# EAGLE design Baselli (EAGLE 6.5.0)
CREVISION: 0.1; DESIGNER: Pekka Nikander
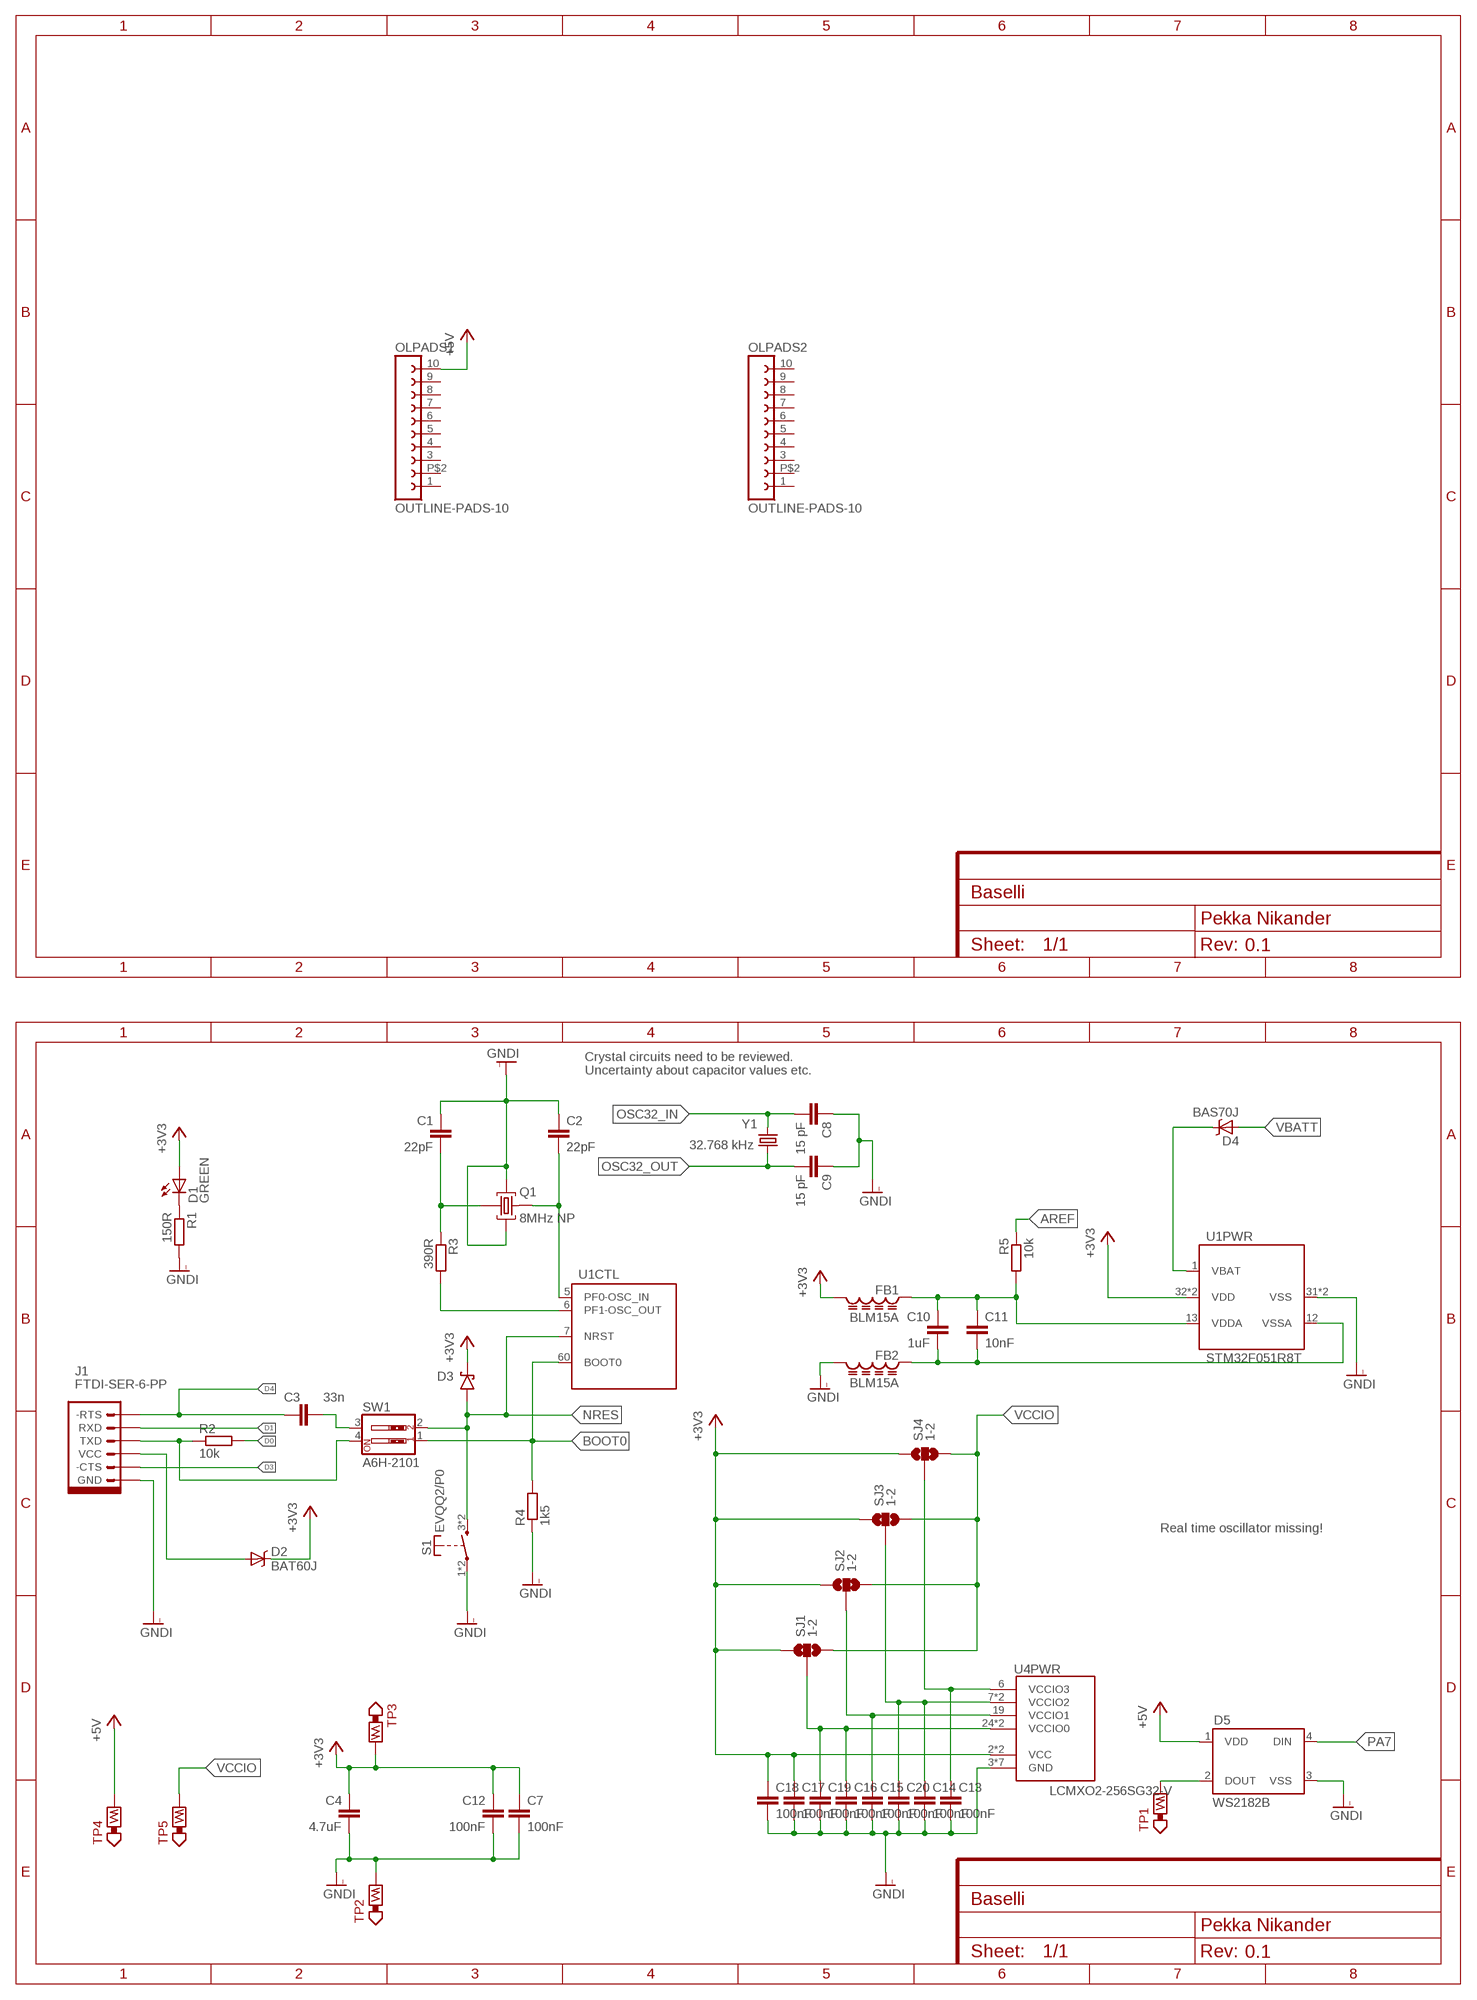
[diagram p0: schematic, sheet 1, part 1 of 2]
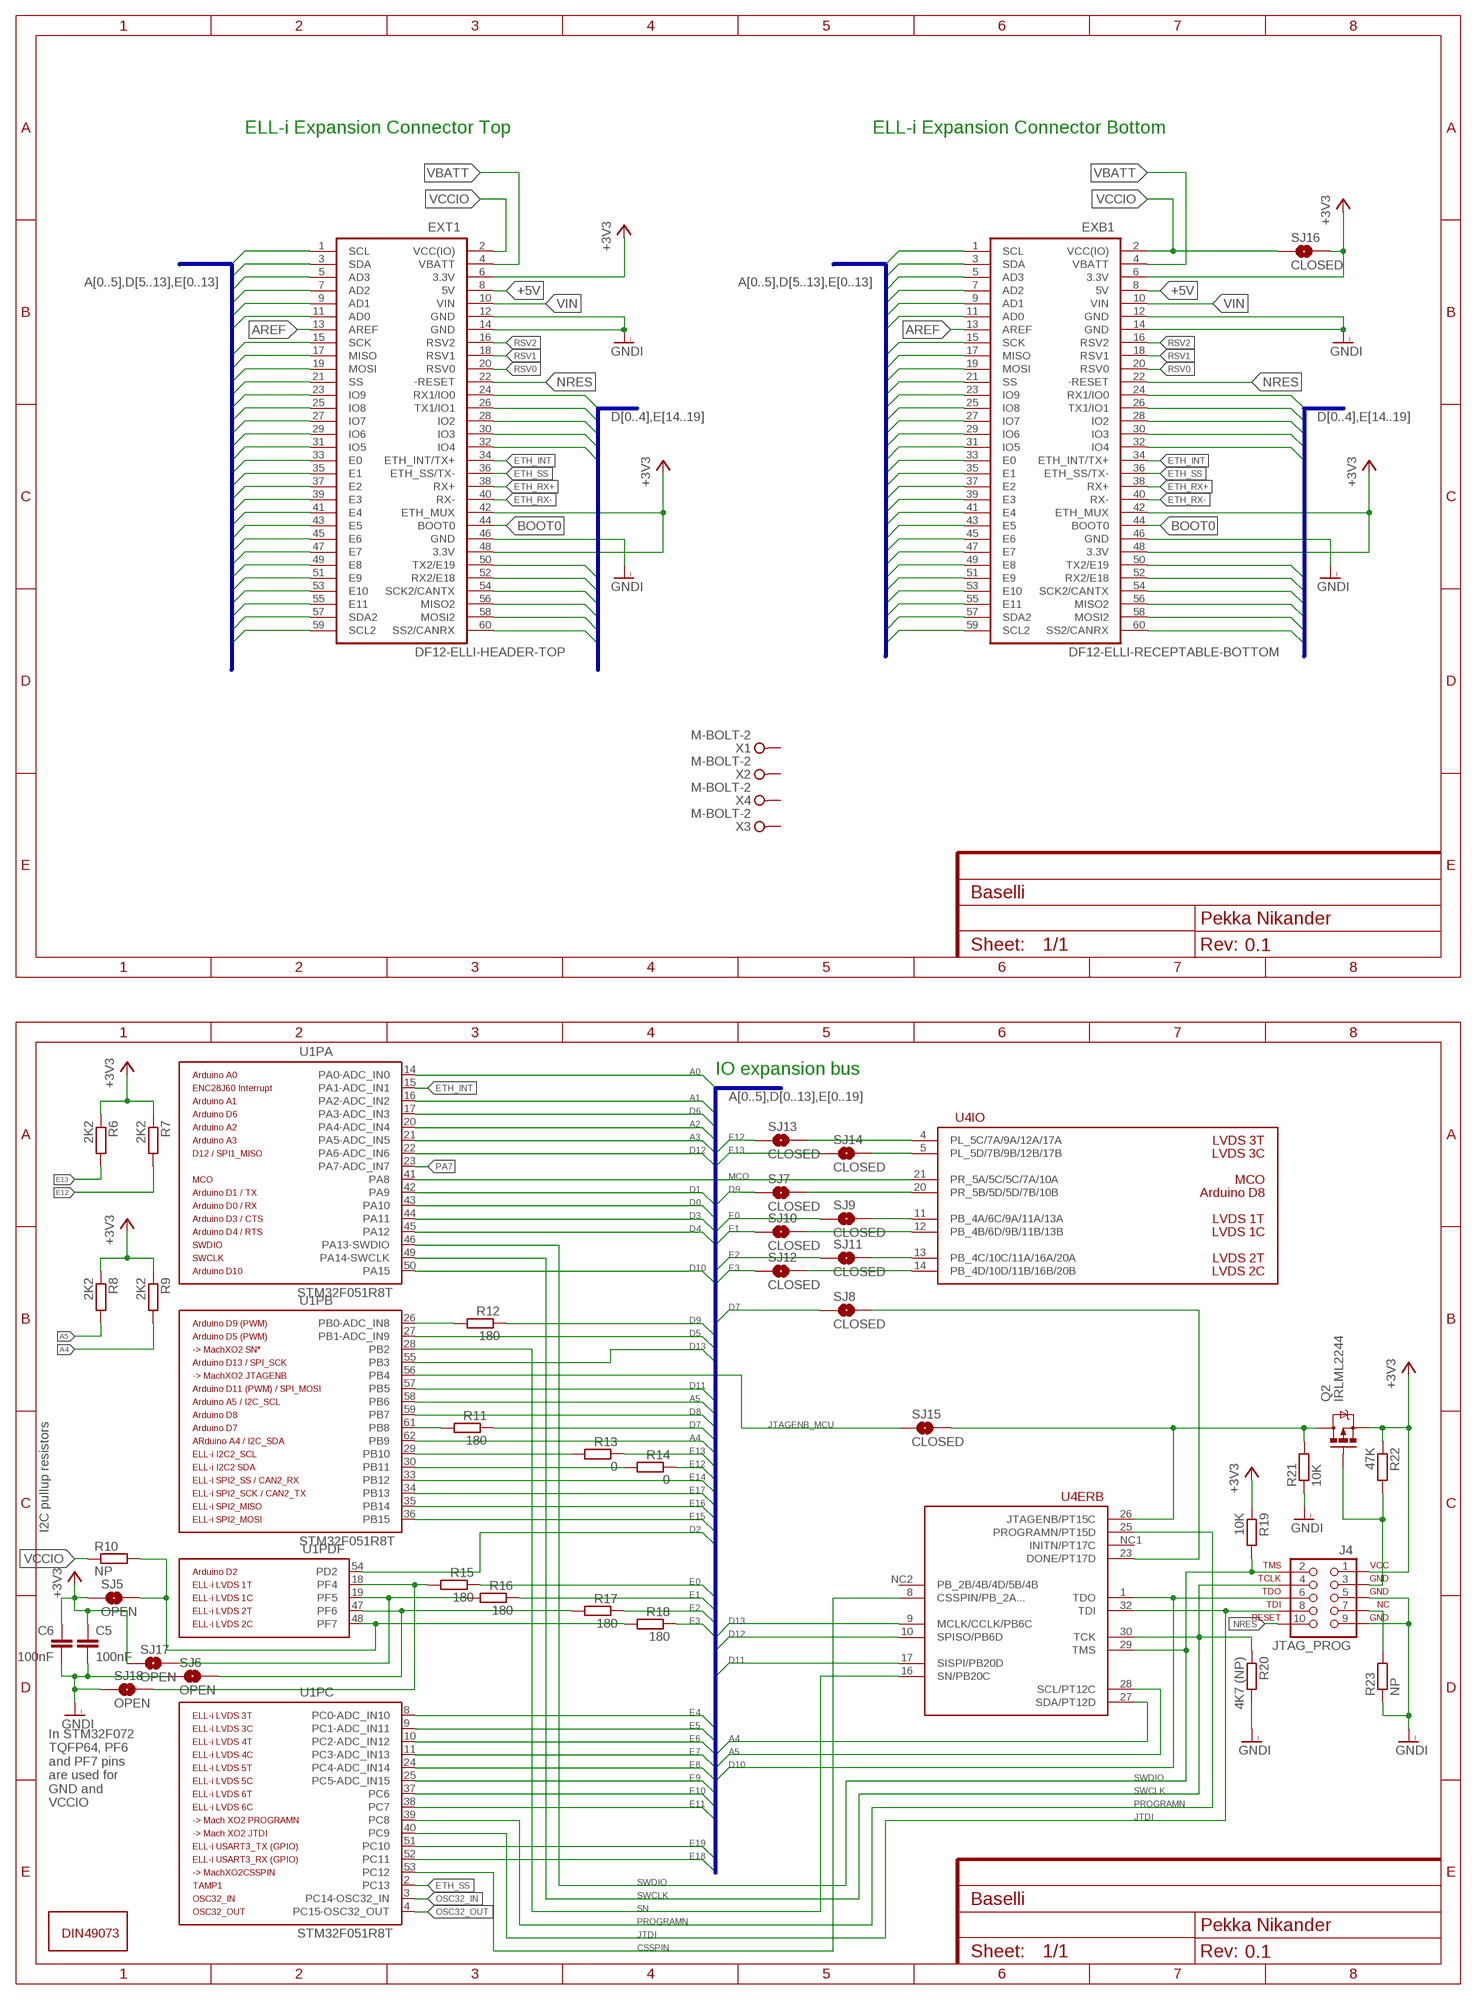
[diagram p1: schematic, sheet 1, part 2 of 2]

## Parts
C1  22pF  C0402  [C0402]
C2  22pF  C0402  [C0402]
C3  33n  C0402  [C0402]
C4  4.7uF  C0402  [C0402]
C5  100nF  C0402  [C0402]
C6  100nF  C0402  [C0402]
C7  100nF  C0402  [C0402]
C8  15 pF  C0402  [C0402]
C9  15 pF  C0402  [C0402]
C10  1uF  C0402  [C0402]
C11  10nF  C0402  [C0402]
C12  100nF  C0402  [C0402]
C13  100nF  C0402  [C0402]
C14  100nF  C0402  [C0402]
C15  100nF  C0402  [C0402]
C16  100nF  C0402  [C0402]
C17  100nF  C0402  [C0402]
C18  100nF  C0402  [C0402]
C19  100nF  C0402  [C0402]
C20  100nF  C0402  [C0402]
D1  GREEN  LED-GREEN0603  [LED-0603]
D2  BAT60J  DIODE-SCHOTTKY-BAT60J  [SOD-323]
D3  BAT60J  [SOD323_DIODE]
D4  BAS70J  [SOD-323]
D5  WS2182B  WS2812B  [WS2812B]
DIMENSIONS1  DIN49073-OUTLINE  [DIN49073-1:2010-02-OUTLINE]
EXB1  DF12-ELLI-RECEPTABLE-BOTTOM  [DF12-60DS-0.5V]
EXT1  DF12-ELLI-HEADER-TOP  [DF12(4.0)-60DP-0.5V]
FB1  BLM15A  LQM15  [0402]
FB2  BLM15A  LQM15  [0402]
J1  FTDI-SER-6-PP  [FTDI-SER-6-SIL]
J4  JTAG_PROG  [CLP-105-02-X-D]
OLPADS1  OUTLINE-PADS-10  [DIN49073-1:2010-02-PADS-10]
OLPADS2  OUTLINE-PADS-10  [DIN49073-1:2010-02-PADS-10]
Q1  8MHz NP  CRYSTAL_WITH_GND  [CRYSTAL-SMD-3225-GND]
Q2  IRLML2244  MOSFET-PCHANNELIRLML2244  [SOT23-3]
R1  150R  R0402  [R0402]
R2  10k  R0402  [R0402]
R3  390R  R0402  [R0402]
R4  1k5  R0402  [R0402]
R5  10k  R0805  [R0805]
R6  2K2  R0402  [R0402]
R7  2K2  R0402  [R0402]
R8  2K2  R0402  [R0402]
R9  2K2  R0402  [R0402]
R10  NP  R0805  [R0805]
R11  180  R0805  [R0805]
R12  180  R0805  [R0805]
R13  0  R0805  [R0805]
R14  0  R0805  [R0805]
R15  180  R0805  [R0805]
R16  180  R0805  [R0805]
R17  180  R0805  [R0805]
R18  180  R0805  [R0805]
R19  10K  R0402  [R0402]
R20  4K7 (NP)  R0603  [R0603]
R21  10K  R0402  [R0402]
R22  47K  R0402  [R0402]
R23  NP  R0805  [R0805]
S1  EVQQ2/P0  [EVQQ2/P0]
SJ1  1-2  SOLDERJUMPER_2WAYPASTE1&2  [SJ_3_PASTE1&2]
SJ2  1-2  SOLDERJUMPER_2WAYPASTE1&2  [SJ_3_PASTE1&2]
SJ3  1-2  SOLDERJUMPER_2WAYPASTE1&2  [SJ_3_PASTE1&2]
SJ4  1-2  SOLDERJUMPER_2WAYPASTE1&2  [SJ_3_PASTE1&2]
SJ5  OPEN  SOLDERJUMPERNO  [SJ_2S-NO]
SJ6  OPEN  SOLDERJUMPERNO  [SJ_2S-NO]
SJ7  CLOSED  SOLDERJUMPERTRACE  [SJ_2S-TRACE]
SJ8  CLOSED  SOLDERJUMPERTRACE  [SJ_2S-TRACE]
SJ9  CLOSED  SOLDERJUMPERTRACE  [SJ_2S-TRACE]
SJ10  CLOSED  SOLDERJUMPERTRACE  [SJ_2S-TRACE]
SJ11  CLOSED  SOLDERJUMPERTRACE  [SJ_2S-TRACE]
SJ12  CLOSED  SOLDERJUMPERTRACE  [SJ_2S-TRACE]
SJ13  CLOSED  SOLDERJUMPERTRACE  [SJ_2S-TRACE]
SJ14  CLOSED  SOLDERJUMPERTRACE  [SJ_2S-TRACE]
SJ15  CLOSED  SOLDERJUMPERTRACE  [SJ_2S-TRACE]
SJ16  CLOSED  SOLDERJUMPERTRACE  [SJ_2S-TRACE]
SJ17  OPEN  SOLDERJUMPERNO  [SJ_2S-NO]
SJ18  OPEN  SOLDERJUMPERNO  [SJ_2S-NO]
SW1  A6H-2101  SW_DIP-2-SMT-HALFSIZE  [DIPSWITCH-02-50MIL]
TP1  TEST_POINT-5000  [TP_5021]
TP2  TEST_POINT-5000  [TP_5021]
TP3  TEST_POINT-5000  [TP_5021]
TP4  TEST_POINT-5000  [TP_5021]
TP5  TEST_POINT-5000  [TP_5021]
U1  STM32F051R8T  [LQFP64]
U4  LCMXO2-256SG32-V  [QFN-32-PAD-VIAS]
X1  M-BOLT-2  [M2-1]
X2  M-BOLT-2  [M2-1]
X3  M-BOLT-2  [M2-1]
X4  M-BOLT-2  [M2-1]
Y1  32.768 kHz  CRYSTAL32-SMD  [CRYSTAL-32KHZ-SMD]

## Nets
+3V3 [power]: C4.1 C5.1 C6.1 C7.1 C12.1 C17.1 C18.1 D1.A D2.C D3.1(C) EXB1.6(3.3V) EXB1.42(ETH_MUX) EXB1.48(3.3V) EXT1.6(3.3V) EXT1.42(ETH_MUX) EXT1.48(3.3V) FB1.2 J4.1 Q2.2(S) R6.1 R7.1 R8.1 R9.1 R19.1 R22.1 SJ1.1 SJ2.1 SJ3.1 SJ4.1 SJ5.1 SJ16.2 SJ17.1 TP3.P$1 U1.32(PWR:VDD) U1.64(PWR:VDD) U4.2(PWR:VCC) U4.18(PWR:VCC)
+5V [power]: D5.1(VDD) EXB1.8(5V) EXT1.8(5V) OLPADS1.10 TP4.P$1
-RTS: C3.2 SW1.3
A0: EXB1.11(AD0) EXT1.11(AD0) U1.14(PA:PA0-ADC_IN0)
A1: EXB1.9(AD1) EXT1.9(AD1) U1.16(PA:PA2-ADC_IN2)
A2: EXB1.7(AD2) EXT1.7(AD2) U1.20(PA:PA4-ADC_IN4)
A3: EXB1.5(AD3) EXT1.5(AD3) U1.21(PA:PA5-ADC_IN5)
A4: EXB1.3(SDA) EXT1.3(SDA) R9.2 U1.62(PB:PB9) U4.27(ERB:SDA/PT12D)
A5: EXB1.1(SCL) EXT1.1(SCL) R8.2 U1.58(PB:PB6) U4.28(ERB:SCL/PT12C)
AREF [power]: EXB1.13(AREF) EXT1.13(AREF) R5.1
BOOT0: EXB1.44(BOOT0) EXT1.44(BOOT0) R4.2 SW1.1 U1.60(CTL:BOOT0)
BOOT0TX: J1.TXD R2.1 SW1.4
CSSPIN: U1.53(PC:PC12) U4.8(ERB:CSSPIN/PB_2A...)
D0: EXB1.24(RX1/IO0) EXT1.24(RX1/IO0) R2.2 U1.43(PA:PA10)
D1: EXB1.26(TX1/IO1) EXT1.26(TX1/IO1) J1.RXD U1.42(PA:PA9)
D2: EXB1.28(IO2) EXT1.28(IO2) U1.54(PDF:PD2)
D3: EXB1.30(IO3) EXT1.30(IO3) J1.-CTS U1.44(PA:PA11)
D4: C3.1 EXB1.32(IO4) EXT1.32(IO4) J1.-RTS U1.45(PA:PA12)
D5: EXB1.31(IO5) EXT1.31(IO5) U1.27(PB:PB1-ADC_IN9)
D6: EXB1.29(IO6) EXT1.29(IO6) U1.17(PA:PA3-ADC_IN3)
D7: EXB1.27(IO7) EXT1.27(IO7) R11.1 SJ8.1
D8: EXB1.25(IO8) EXT1.25(IO8) U1.59(PB:PB7)
D9: EXB1.23(IO9) EXT1.23(IO9) R12.1 SJ7.1
D10: EXB1.21(SS) EXT1.21(SS) J4.6 U1.50(PA:PA15) U4.1(ERB:TDO)
D11: EXB1.19(MOSI) EXT1.19(MOSI) U1.57(PB:PB5) U4.17(ERB:SISPI/PB20D)
D12: EXB1.17(MISO) EXT1.17(MISO) U1.22(PA:PA6-ADC_IN6) U4.10(ERB:SPISO/PB6D)
D13: EXB1.15(SCK) EXT1.15(SCK) U1.55(PB:PB3) U4.9(ERB:MCLK/CCLK/PB6C)
DONE: SJ8.2 U4.23(ERB:DONE/PT17D)
DOUT: D5.2(DOUT) TP1.P$1
E0: EXB1.33(E0) EXT1.33(E0) R15.1 SJ9.1
E1: EXB1.35(E1) EXT1.35(E1) R16.1 SJ10.1
E2: EXB1.37(E2) EXT1.37(E2) R17.1 SJ11.1
E3: EXB1.39(E3) EXT1.39(E3) R18.1 SJ12.1
E4: EXB1.41(E4) EXT1.41(E4) U1.8(PC:PC0-ADC_IN10)
E5: EXB1.43(E5) EXT1.43(E5) U1.9(PC:PC1-ADC_IN11)
E6: EXB1.45(E6) EXT1.45(E6) U1.10(PC:PC2-ADC_IN12)
E7: EXB1.47(E7) EXT1.47(E7) U1.11(PC:PC3-ADC_IN13)
E8: EXB1.49(E8) EXT1.49(E8) U1.24(PC:PC4-ADC_IN14)
E9: EXB1.51(E9) EXT1.51(E9) U1.25(PC:PC5-ADC_IN15)
E10: EXB1.53(E10) EXT1.53(E10) U1.37(PC:PC6)
E11: EXB1.55(E11) EXT1.55(E11) U1.38(PC:PC7)
E12: EXB1.57(SDA2) EXT1.57(SDA2) R7.2 R14.1 SJ13.1
E13: EXB1.59(SCL2) EXT1.59(SCL2) R6.2 R13.1 SJ14.1
E14: EXB1.60(SS2/CANRX) EXT1.60(SS2/CANRX) U1.33(PB:PB12)
E15: EXB1.58(MOSI2) EXT1.58(MOSI2) U1.36(PB:PB15)
E16: EXB1.56(MISO2) EXT1.56(MISO2) U1.35(PB:PB14)
E17: EXB1.54(SCK2/CANTX) EXT1.54(SCK2/CANTX) U1.34(PB:PB13)
E18: EXB1.52(RX2/E18) EXT1.52(RX2/E18) U1.52(PC:PC11)
E19: EXB1.50(TX2/E19) EXT1.50(TX2/E19) U1.51(PC:PC10)
ETH_INT: EXB1.34(ETH_INT/TX+) EXT1.34(ETH_INT/TX+) U1.15(PA:PA1-ADC_IN1)
ETH_RX+: EXB1.38(RX+) EXT1.38(RX+)
ETH_RX-: EXB1.40(RX-) EXT1.40(RX-)
ETH_SS: EXB1.36(ETH_SS/TX-) EXT1.36(ETH_SS/TX-) U1.2(PC:PC13)
GNDI [power]: C1.1 C2.1 C4.2 C5.2 C6.2 C7.2 C8.1 C9.1 C12.2 C13.2 C14.2 C15.2 C16.2 C17.2 C18.2 C19.2 C20.2 D5.3(VSS) EXB1.12(GND) EXB1.14(GND) EXB1.46(GND) EXT1.12(GND) EXT1.14(GND) EXT1.46(GND) FB2.2 J1.GND J4.5 J4.9 Q1.2(GND) Q1.4(GND) R1.2 R4.1 R20.2 R21.1 R23.1 S1.1(P) S1.2(P) SJ6.1 SJ18.1 TP2.P$1 U1.31(PWR:VSS) U1.63(PWR:VSS) U4.3(PWR:GND) U4.22(PWR:GND) U4.EP(PWR:GND) U4.VIA1(PWR:GND) U4.VIA2(PWR:GND) U4.VIA3(PWR:GND) U4.VIA4(PWR:GND)
JTAGEN_GATE: J4.3 Q2.1(G) R22.2
JTAGENB: Q2.3(D) R21.2 SJ15.2 U4.26(ERB:JTAGENB/PT15C)
JTAGENB_MCU: SJ15.1 U1.56(PB:PB4)
JTDI: J4.8 U1.40(PC:PC9) U4.32(ERB:TDI)
MCO: U1.41(PA:PA8) U4.21(IO:PR_5A/5C/5C/7A/10A)
N41567: D1.C R1.1
N205481: C1.2 Q1.1(C1) R3.1
N$5: R11.2 U1.61(PB:PB8)
N$6: J4.7 R23.2
N$7: R12.2 U1.26(PB:PB0-ADC_IN8)
N$9: SJ9.2 U4.11(IO:PB_4A/6C/9A/11A/13A)
N$10: SJ10.2 U4.12(IO:PB_4B/6D/9B/11B/13B)
N$12: SJ7.2 U4.20(IO:PR_5B/5D/5D/7B/10B)
N$15: SJ11.2 U4.13(IO:PB_4C/10C/11A/16A/20A)
N$16: SJ12.2 U4.14(IO:PB_4D/10D/11B/16B/20B)
N$17: SJ13.2 U4.4(IO:PL_5C/7A/9A/12A/17A)
N$20: SJ14.2 U4.5(IO:PL_5D/7B/9B/12B/17B)
NRES: D3.2(A) EXB1.22(-RESET) EXT1.22(-RESET) J4.10 S1.3(S) S1.4(S) SW1.2 U1.7(CTL:NRST)
OSC32_IN: C8.2 U1.3(PC:PC14-OSC32_IN) Y1.X2
OSC32_OUT: C9.2 U1.4(PC:PC15-OSC32_OUT) Y1.X1
PA7: D5.4(DIN) U1.23(PA:PA7-ADC_IN7)
PB10: R13.2 U1.29(PB:PB10)
PB11: R14.2 U1.30(PB:PB11)
PF0: C2.2 Q1.3(C2) U1.5(CTL:PF0-OSC_IN)
PF1: R3.2 U1.6(CTL:PF1-OSC_OUT)
PF4 [power]: R15.2 SJ18.2 U1.18(PDF:PF4)
PF5 [power]: R16.2 SJ17.2 U1.19(PDF:PF5)
PF6 [power]: R17.2 SJ6.2 U1.47(PDF:PF6)
PF7 [power]: R10.2 R18.2 SJ5.2 U1.48(PDF:PF7)
PROGRAMN: U1.39(PC:PC8) U4.25(ERB:PROGRAMN/PT15D)
RSV0: EXB1.20(RSV0) EXT1.20(RSV0)
RSV1: EXB1.18(RSV1) EXT1.18(RSV1)
RSV2: EXB1.16(RSV2) EXT1.16(RSV2)
SN: U1.28(PB:PB2) U4.16(ERB:SN/PB20C)
SWCLK: J4.4 R20.1 U1.49(PA:PA14-SWCLK) U4.30(ERB:TCK)
SWDIO: J4.2 R19.2 U1.46(PA:PA13-SWDIO) U4.29(ERB:TMS)
VBAT: D4.2(C) U1.1(PWR:VBAT)
VBATT: D4.1(A) EXB1.4(VBATT) EXT1.4(VBATT)
VCC-IN [power]: D2.A J1.VCC
VCCIO [power]: EXB1.2(VCC(IO)) EXT1.2(VCC(IO)) R10.1 SJ1.3 SJ2.3 SJ3.3 SJ4.3 SJ16.1 TP5.P$1
VCCIO0 [power]: C16.1 C19.1 SJ1.2 U4.24(PWR:VCCIO0) U4.31(PWR:VCCIO0)
VCCIO1 [power]: C15.1 SJ2.2 U4.19(PWR:VCCIO1)
VCCIO2 [power]: C14.1 C20.1 SJ3.2 U4.7(PWR:VCCIO2) U4.15(PWR:VCCIO2)
VCCIO3 [power]: C13.1 SJ4.2 U4.6(PWR:VCCIO3)
VDDA [power]: C10.1 C11.1 FB1.1 R5.2 U1.13(PWR:VDDA)
VIN: EXB1.10(VIN) EXT1.10(VIN)
VSSA [power]: C10.2 C11.2 FB2.1 U1.12(PWR:VSSA)
Unconnected: OLPADS1.1 OLPADS1.3 OLPADS1.4 OLPADS1.5 OLPADS1.6 OLPADS1.7 OLPADS1.8 OLPADS1.9 OLPADS1.P$2 OLPADS2.1 OLPADS2.3 OLPADS2.4 OLPADS2.5 OLPADS2.6 OLPADS2.7 OLPADS2.8 OLPADS2.9 OLPADS2.10 OLPADS2.P$2 U4.NC1(ERB:INITN/PT17C) U4.NC2(ERB:PB_2B/4B/4D/5B/4B) X1.1(KL1) X2.1(KL1) X3.1(KL1) X4.1(KL1)

## Buses
A[0..5],D[0..13],E[0..19]
A[0..5],D[5..13],E[0..13]
D[0..4],E[14..19]

## Notes on the sheet
- ELL-i Expansion Connector Top | ELL-i Expansion Connector Bottom
- Crystal circuits need to be reviewed.
  Uncertainty about capacitor values etc.
- IO expansion bus
- Real time oscillator missing! | I2C pullup resistors
- In STM32F072 
  TQFP64, PF6 
  and PF7 pins 
  are used for 
  GND and 
  VCCIO

## Library data of the parts
C1-C20 = ELL-i-Passives:C: Surface Mount Capasitors — in standard sizes A capacitor used to store energy electrostatically in an electric field. If you need a high-value capacitor, consider using a polarised capacitor to save space. Wikipedia article on capacitors <https://en.wikipedia.org/wiki/Capacitor>
D1 = SparkFun-LED:LED-GREEN: Various green LEDs Green LEDs used in SFE Production 0603- DIO-00821 LARGE- DIO-00862 LILYPAD- DIO-09910; PROD_ID: DIO-00821
D2 = SparkFun-DiscreteSemi:DIODE-SCHOTTKY: Schottky diodes BAT20J 1A 23V 0.62Vf BAT60J 3A 10V 0.53Vf (Datasheet <http://www.st.com/st-web-ui/static/active/en/resource/technical/document/datasheet/CD00001944.pdf>) RB751 120mA 40V 0.37Vf PMEG4005EJ 0.5A 40V 0.42Vf MBRA140 1A 40V 0.5Vf B340A 3A 40V SMA MBR120 20V 1A SOD123FL (Datasheet <http://www.mouser.com/ds/2/308/MBR120VLSFT1-D-107081.pdf>)
D3 = ell-i:BAT60J
D4 = ELL-i-DiscreteSemi:BAS70: Silicon Schottky Diodes General-purpose diode for high-speed switching. Maximum forward current 70 mA Maxiumum forward voltage drop Vf 0.410 mV Maximum reverse voltage 70V
D5 = SparkFun-LED:WS2812B: WS2812B - Intelligent control LED integrated light source Technical Specifications: Power Supply Voltage (VDD): 3.5 to 5.3 V Input Voltage (VI): -0.5 to VDD+0.5 V Operating Junction Temperature (Topt): -25°C to +80°C Storage Temperature Range (Tstg): -55°C to +150°C
DIMENSIONS1 = ELL-i-Boards:DIN49073: DIN49073 board Used to document in the schematic that the board outline is comliant with the DN49073 standard, and to select an appropriate dimension for the actual board.
EXB1 EXT1 = ELL-i-Connectors:DF12-ELLI-*
FB1 FB2 = ell-i:LQM15
J1 = ELL-i-Connectors:FTDI-SER-6: FTDI cable connector In several package variant, including pogopin version.
J4 = ELL-i-Connectors:JTAG_PROG: JTAG 10-pin ICSP Header This is an ARM / Keil compatible 10-pin 1.27 mm pitch In Circuit Serial Programming (ICSP) JTAG header. Keil Connectors <http://www.keil.com/support/man/docs/ulink2/ulink2_hw_connectors.htm>
OLPADS1 OLPADS2 = ELL-i-Boards:OUTLINE-PADS-10
Q1 = SparkFun-FreqCtrl:CRYSTAL_WITH_GND: Crystals with ground connection to case. A ground connection is used for mechanical stability and to minimize noise. Be careful to not overheat the body of crystal while soldering.
Q2 = SparkFun-DiscreteSemi:MOSFET-PCHANNEL: Generic PMOSFET; PROD_ID: TRANS-11153
R1-R23 = ELL-i-Passives:R: Surface Mount Resistor — in standard sizes
S1 = ell-i:EVQQ2/P0
SJ1-SJ4 = SparkFun-Passives:SOLDERJUMPER_2WAY: Solder Jumper 2 way solder jumper
SJ5-SJ18 = SparkFun-Passives:SOLDERJUMPER: Solder Jumper Standard SMD solder jumper. Used to automate production. Two varients : Normally Open and Normally Closed are the same, but have different paste layers. NC will have a large amount of paste and should jumper during reflow.
SW1 = SparkFun-Electromechanical:SW_DIP-2: DIP SWITCH
TP1-TP5 = ELL-i-Passives:TEST_POINT: Used for easier attachment of measuring equipment. Has both test loops and bare copper area.
U1 = ELL-i-DigitalIC:STM32F051R: STM32F051 in LQPF64 package. STM32F0-series Cortex-M0 microcontroller in 64 lead package. Datasheet <http://www.st.com/web/en/resource/technical/document/datasheet/DM00039193.pdf> (DM00039193.pdf) .; FLASH: 64K
U4 = ELL-i-DigitalIC:LCMXO2-256*SG32: MachXO2-256 in 32-pin QFN package. Lattice MachXO2-series FPGA in a 32-pin QFN package, 0.5 mm pitch. Datasheet <http://www.latticesemi.com/~/media/Documents/DataSheets/MachXO23/MachXO2FamilyDataSheet.pdf> (DS1035) .
X1-X4 = ELL-i-Connectors:M-BOLT: Metric bolt connector
Y1 = SparkFun-FreqCtrl:CRYSTAL: Various standard crystals. Proven footprints. Spark Fun Electronics SKU : COM-00534; PROD_ID: XTAL-07894

## Net classes
0 default: width 0.1 mm, drill 0.3 mm, clearance 0.1 mm
1 power: width 0.3 mm, drill 0.5 mm, clearance 0.15 mm
2 high_voltage: width 0.15 mm, drill 0.3 mm, clearance 0.5 mm
3 high_power: width 0.5 mm, drill 0.6 mm, clearance 0.15 mm

## Board
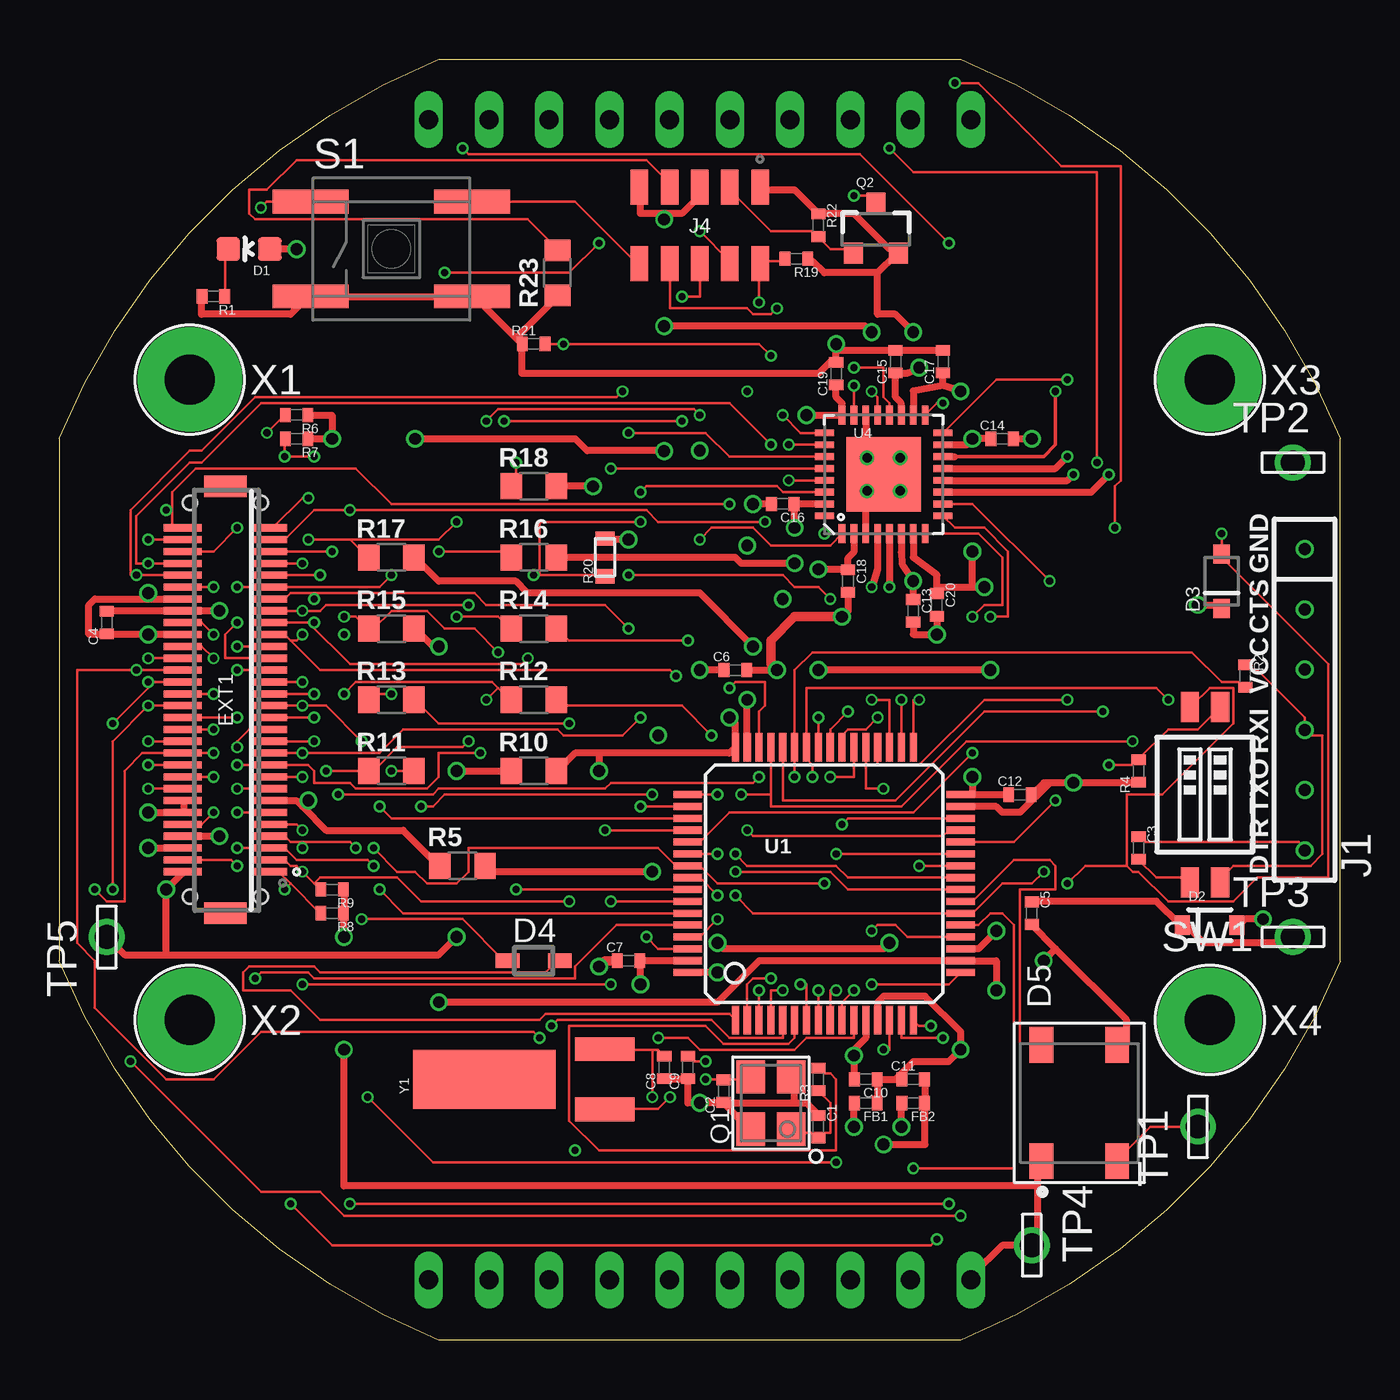
[diagram p2: board, top side]
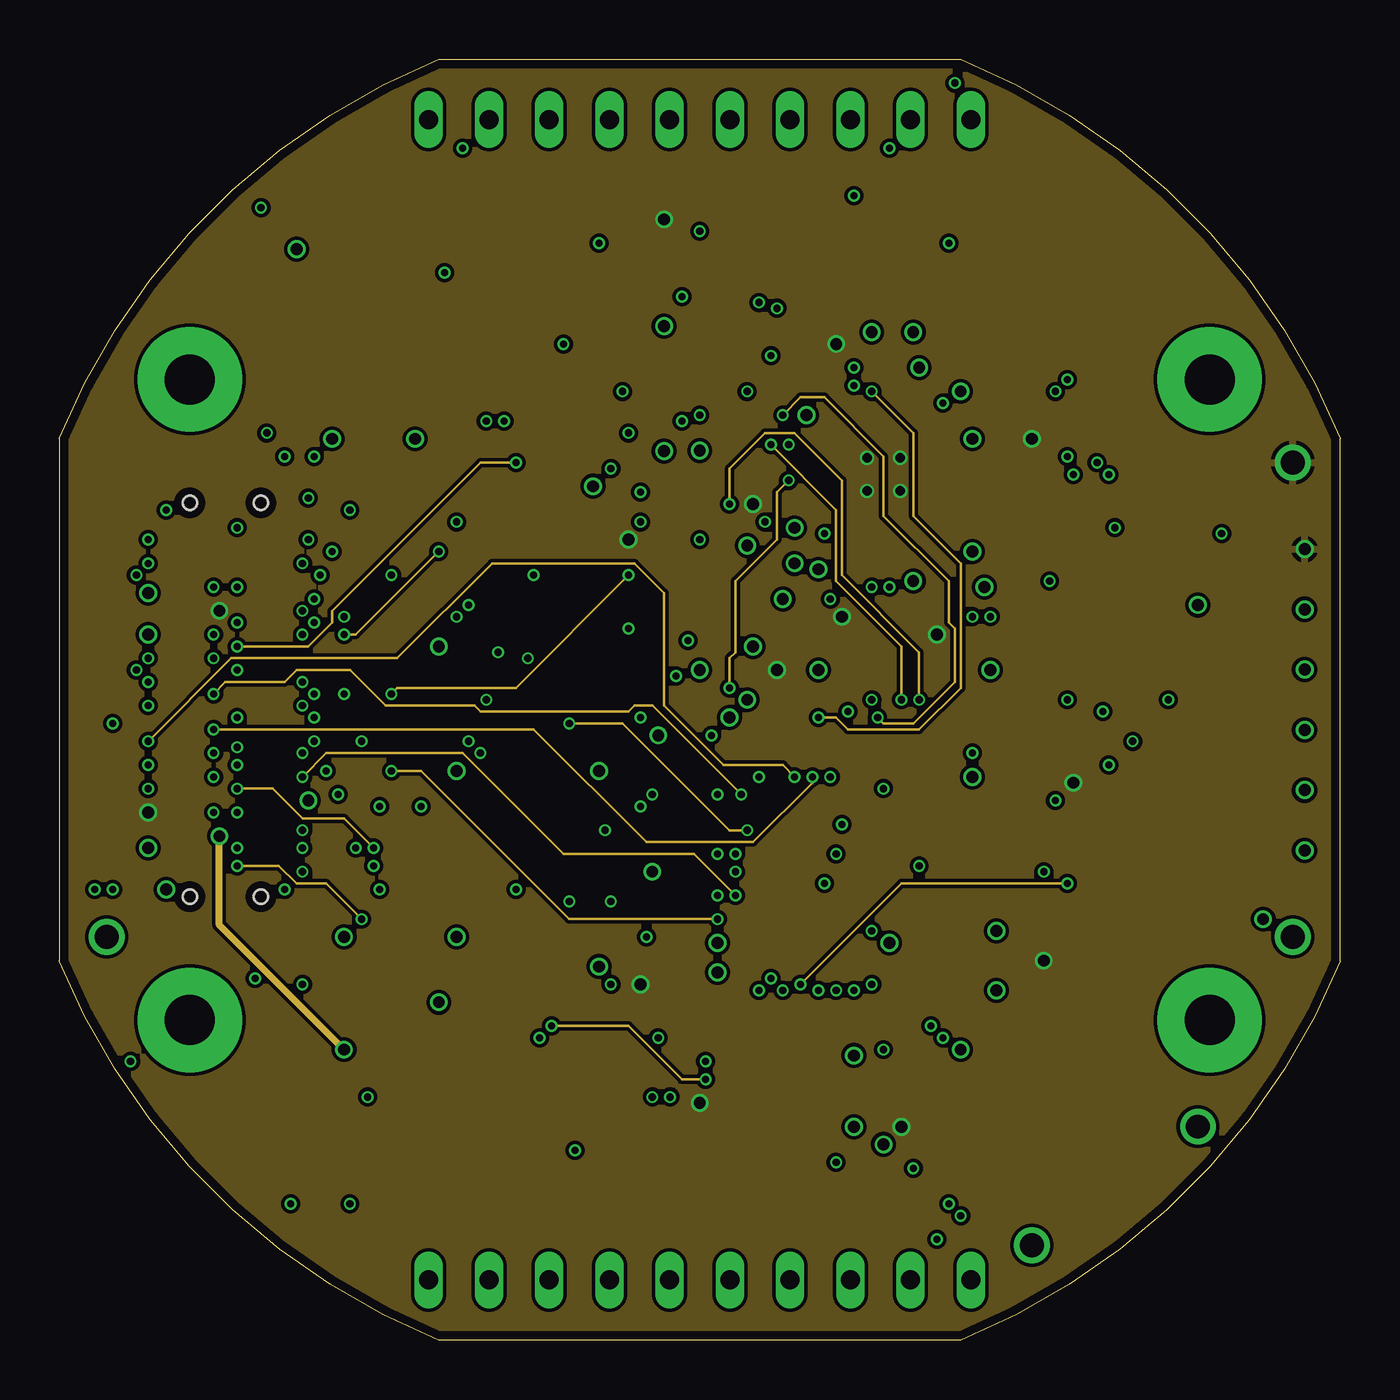
[diagram p3: board, inner layer Layer2]
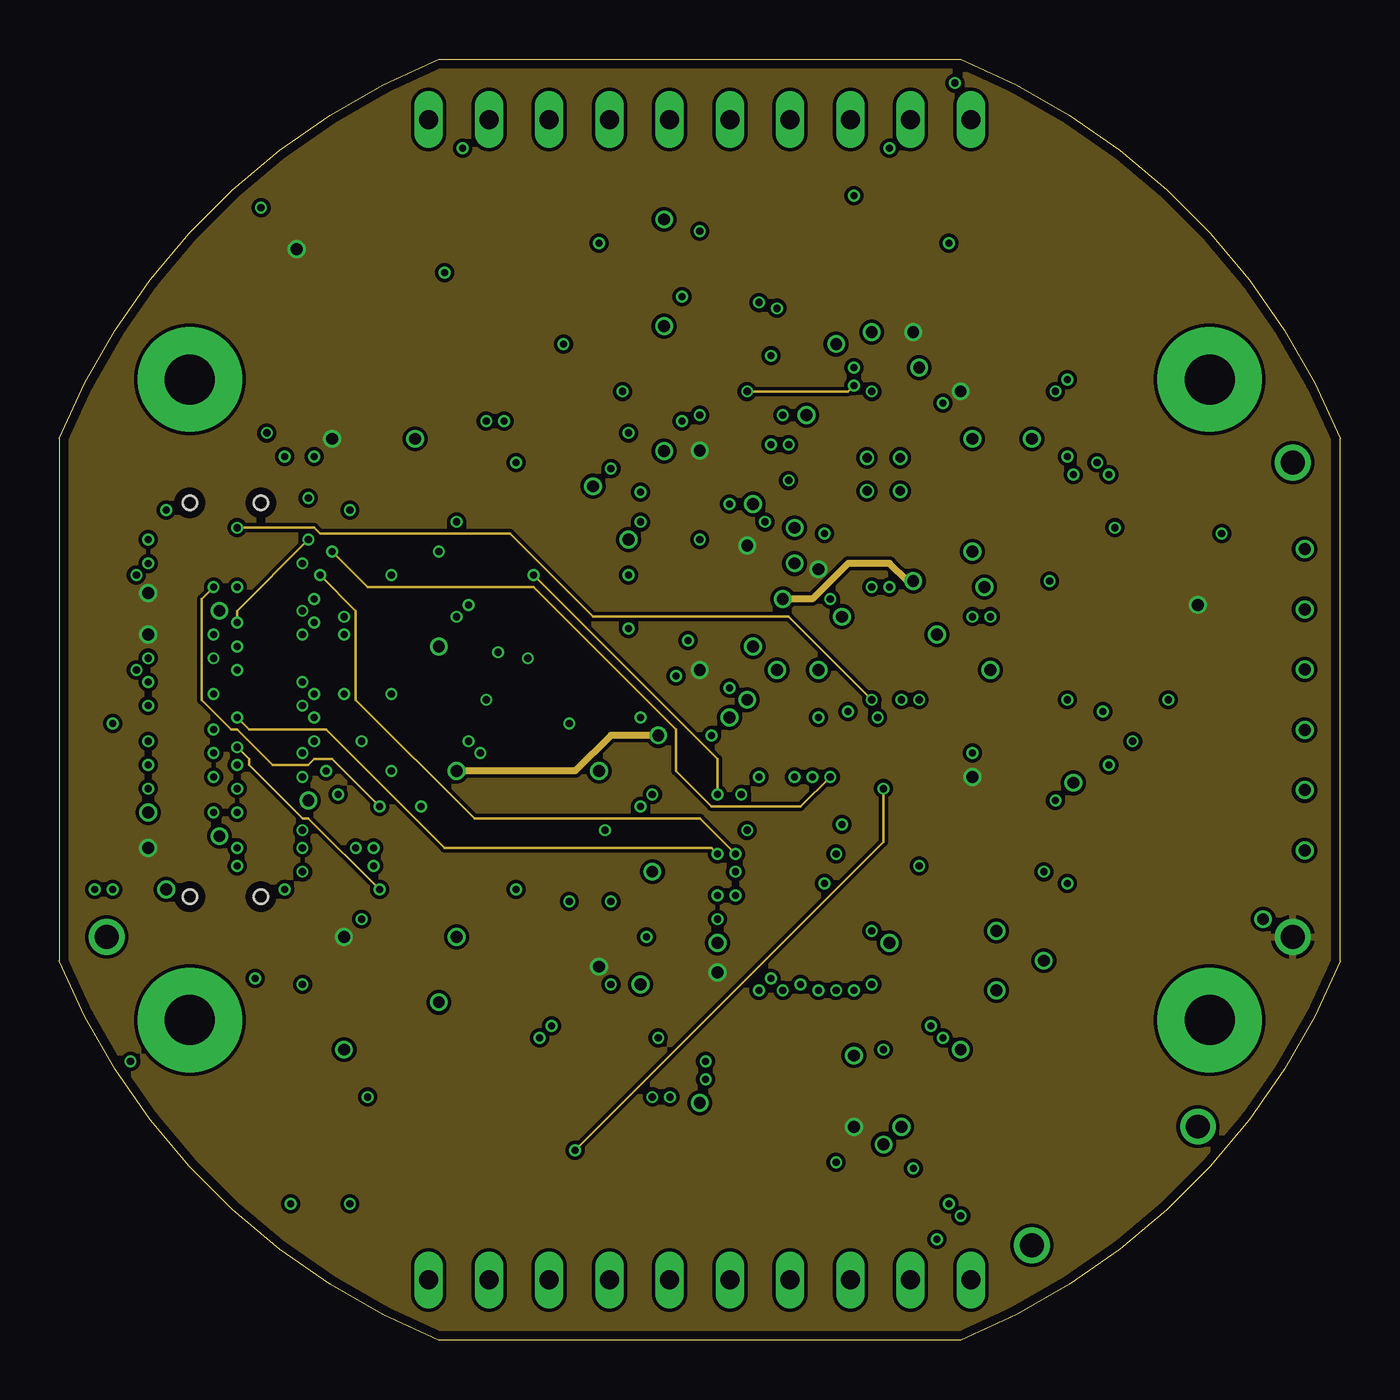
[diagram p4: board, inner layer Layer3]
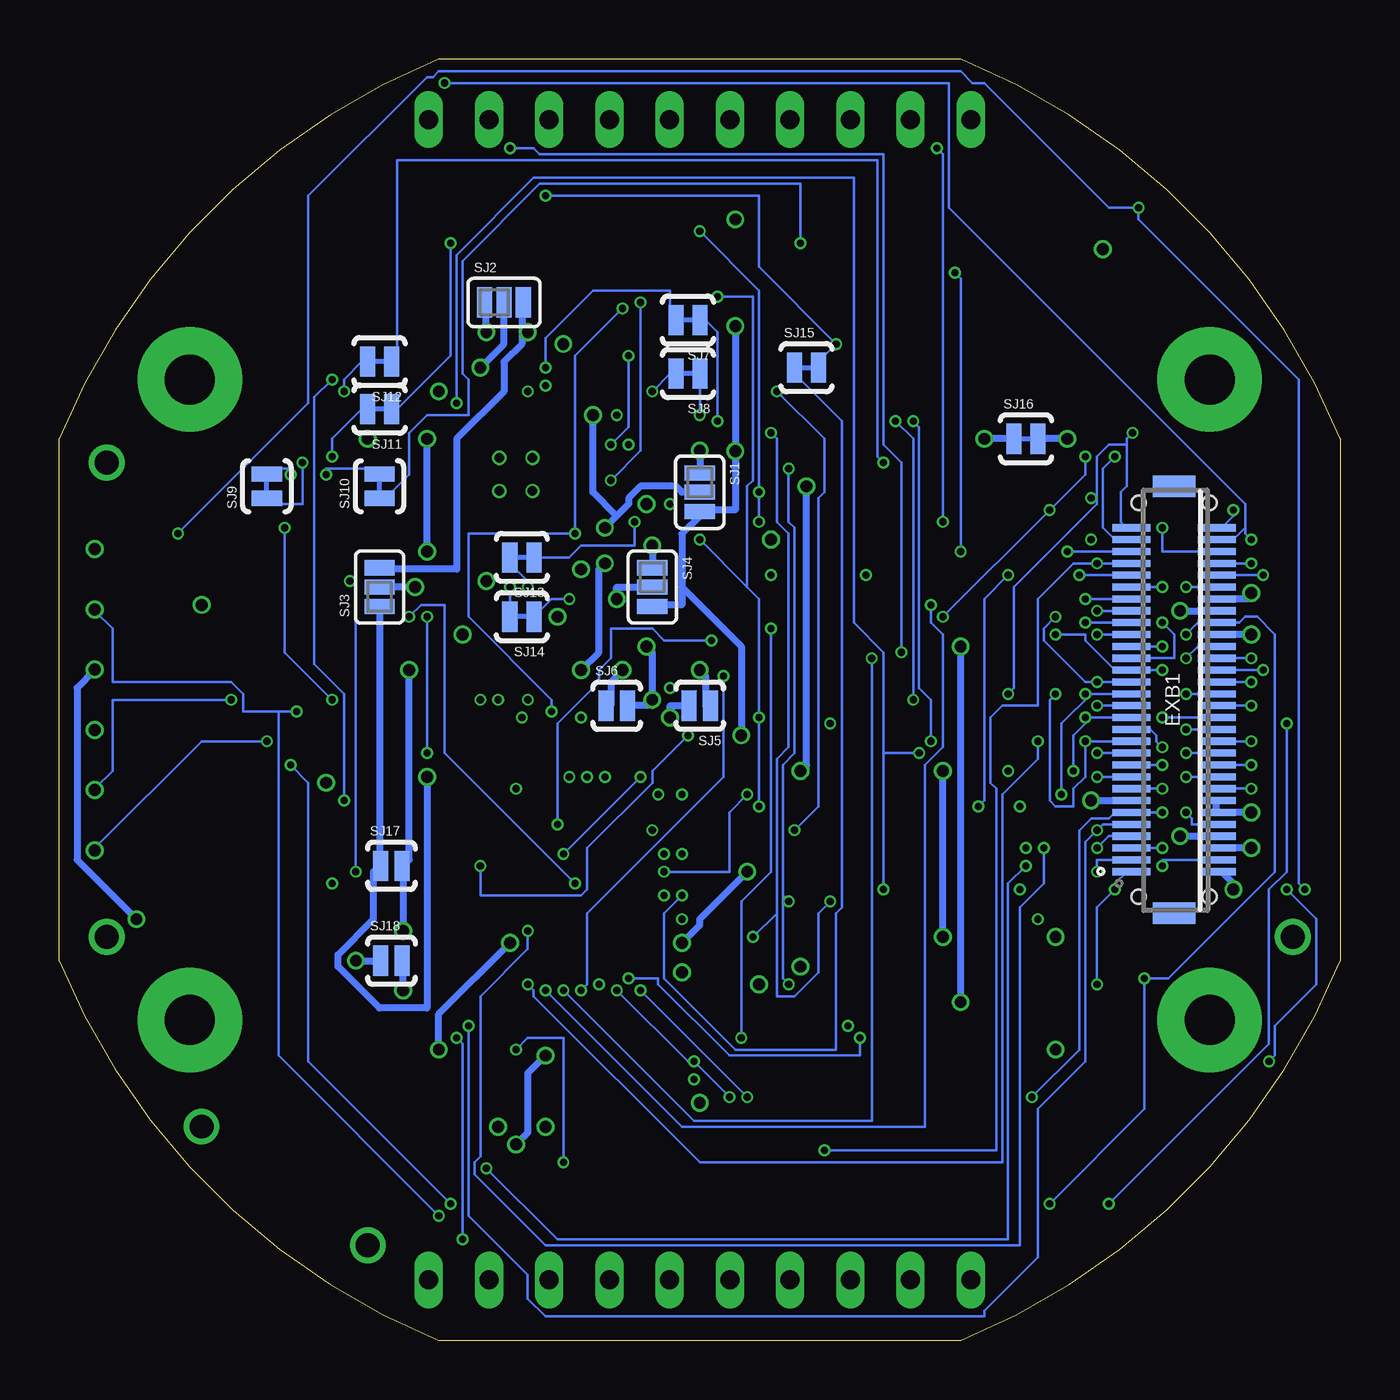
[diagram p5: board, bottom side, seen from below]

Size 54 x 54 mm. Coordinates in mm from the lower left corner, seen from the top.
Copper layers (1*2*15*16): Top 0.035mm / dielectric 0.2mm / Layer2 0.035mm / dielectric 1mm / Layer3 0.035mm / dielectric 0.2mm / Bottom 0.035mm
Design rules "Ell-duino *": minimum track width 0.1mm, minimum drill 0.2mm, track to track 0.1mm, track to pad 0.1mm, pad to pad 0.2mm, via to via 0.2mm, smd to smd 0.1mm, copper to edge 0.35mm, drill to drill 0.4mm, minimum pad ring 0.1mm, minimum via ring 0.1mm, stop-mask expansion 2mil, vias tented up to drill 0.29mm, thermal gap 0.18mm

### Footprints (pad centres in the part's own frame; a part is rotated, then mirrored left to right if it is on the bottom)
C0402 = smd 0.45 x 0.6: 1 -0.475,0; 2 0.475,0
LED-0603 = smd 1 x 1: A 0,-0.877; C 0,0.877
SOD-323 = smd 0.63 x 0.83: A 1.15,0; C -1.15,0
SOD323_DIODE = smd 0.8 x 0.7: 1 -1.15,0; 2 1.15,0
SOD-323' = smd 1 x 0.6: 1 -1.1,0; 2 1.1,0
WS2812B = smd 1.5 x 1: 1 -2.45,1.6; 2 -2.45,-1.6; 3 2.45,-1.6; 4 2.45,1.6
DF12-60DS-0.5V = smd 0.3 x 1.6: 1 -7.25,1.8; 2 -7.25,-1.8; 3 -6.75,1.8; 4 -6.75,-1.8; 5 -6.25,1.8; 6 -6.25,-1.8; 7 -5.75,1.8; 8 -5.75,-1.8; 9 -5.25,1.8; 10 -5.25,-1.8; 11 -4.75,1.8; 12 -4.75,-1.8; 13 -4.25,1.8; 14 -4.25,-1.8; 15 -3.75,1.8; 16 -3.75,-1.8; 17 -3.25,1.8; 18 -3.25,-1.8; 19 -2.75,1.8; 20 -2.75,-1.8; 21 -2.25,1.8; 22 -2.25,-1.8; 23 -1.75,1.8; 24 -1.75,-1.8; 25 -1.25,1.8; 26 -1.25,-1.8; 27 -0.75,1.8; 28 -0.75,-1.8; 29 -0.25,1.8; 30 -0.25,-1.8; 31 0.25,1.8; 32 0.25,-1.8; 33 0.75,1.8; 34 0.75,-1.8; 35 1.25,1.8; 36 1.25,-1.8; 37 1.75,1.8; 38 1.75,-1.8; 39 2.25,1.8; 40 2.25,-1.8; 41 2.75,1.8; 42 2.75,-1.8; 43 3.25,1.8; 44 3.25,-1.8; 45 3.75,1.8; 46 3.75,-1.8; 47 4.25,1.8; 48 4.25,-1.8; 49 4.75,1.8; 50 4.75,-1.8; 51 5.25,1.8; 52 5.25,-1.8; 53 5.75,1.8; 54 5.75,-1.8; 55 6.25,1.8; 56 6.25,-1.8; 57 6.75,1.8; 58 6.75,-1.8; 59 7.25,1.8; 60 7.25,-1.8 | smd 0.9 x 1.8: F1 -9,0; F2 9,0 | hole 0.6: -8.3,1.5; 8.3,1.5
DF12(4.0)-60DP-0.5V = smd 0.3 x 1.6: 1 -7.25,-1.8; 2 -7.25,1.8; 3 -6.75,-1.8; 4 -6.75,1.8; 5 -6.25,-1.8; 6 -6.25,1.8; 7 -5.75,-1.8; 8 -5.75,1.8; 9 -5.25,-1.8; 10 -5.25,1.8; 11 -4.75,-1.8; 12 -4.75,1.8; 13 -4.25,-1.8; 14 -4.25,1.8; 15 -3.75,-1.8; 16 -3.75,1.8; 17 -3.25,-1.8; 18 -3.25,1.8; 19 -2.75,-1.8; 20 -2.75,1.8; 21 -2.25,-1.8; 22 -2.25,1.8; 23 -1.75,-1.8; 24 -1.75,1.8; 25 -1.25,-1.8; 26 -1.25,1.8; 27 -0.75,-1.8; 28 -0.75,1.8; 29 -0.25,-1.8; 30 -0.25,1.8; 31 0.25,-1.8; 32 0.25,1.8; 33 0.75,-1.8; 34 0.75,1.8; 35 1.25,-1.8; 36 1.25,1.8; 37 1.75,-1.8; 38 1.75,1.8; 39 2.25,-1.8; 40 2.25,1.8; 41 2.75,-1.8; 42 2.75,1.8; 43 3.25,-1.8; 44 3.25,1.8; 45 3.75,-1.8; 46 3.75,1.8; 47 4.25,-1.8; 48 4.25,1.8; 49 4.75,-1.8; 50 4.75,1.8; 51 5.25,-1.8; 52 5.25,1.8; 53 5.75,-1.8; 54 5.75,1.8; 55 6.25,-1.8; 56 6.25,1.8; 57 6.75,-1.8; 58 6.75,1.8; 59 7.25,-1.8; 60 7.25,1.8 | smd 0.9 x 1.8: F1 -9,0; F2 9,0 | hole 0.6: -8.3,1.5; 8.3,1.5
0402 = smd 0.45 x 0.6: 1 -0.475,0; 2 0.475,0
FTDI-SER-6-SIL = drill 0.508: -CTS 3.81,0; -RTS -6.35,0; GND 6.35,0; RXD -3.81,0; TXD -1.27,0; VCC 1.27,0
CLP-105-02-X-D = smd 0.737 x 1.473: 1 -2.54,-1.613; 2 -2.54,1.613; 3 -1.27,-1.613; 4 -1.27,1.613; 5 0,-1.613; 6 0,1.613; 7 1.27,-1.613; 8 1.27,1.613; 9 2.54,-1.613; 10 2.54,1.613
DIN49073-1:2010-02-PADS-10 = drill 0.8 long: 1 -11.43,0; 3 -6.35,0; 4 -3.81,0; 5 -1.27,0; 6 1.27,0; 7 3.81,0; 8 6.35,0; 9 8.89,0; 10 11.43,0; P$2 -8.89,0
CRYSTAL-SMD-3225-GND = smd 1.4 x 1.2: 1 -1.1,-0.85; 2 1.1,-0.85; 3 1.1,0.85; 4 -1.1,0.85
SOT23-3 = smd 0.8 x 0.9: 1 -0.95,-1; 2 0.95,-1; 3 0,1.1
R0402 = smd 0.45 x 0.6: 1 -0.475,0; 2 0.475,0
R0805 = smd 0.9 x 1.1: 1 -0.95,0; 2 0.95,0
R0603 = smd 0.6 x 0.8: 1 -0.8,0; 2 0.8,0
EVQQ2/P0 = smd 3.2 x 1: 1 3.4,-2; 2 -3.4,-2; 3 3.4,2; 4 -3.4,2
SJ_3_PASTE1&2 = smd 0.635 x 1.27: 1 -0.813,0; 2 0,0; 3 0.813,0
SJ_2S-NO = smd 0.635 x 1.27: 1 -0.45,0; 2 0.45,0
SJ_2S-TRACE = smd 0.635 x 1.27: 1 -0.508,0; 2 0.508,0
DIPSWITCH-02-50MIL = smd 0.762 x 1.27: 1 -0.635,-3.7; 2 0.635,-3.7; 3 0.635,3.7; 4 -0.635,3.7
TP_5021 = drill 1: P$1 0,0
LQFP64 = smd 0.3 x 1.2: 1 -3.75,-5.75; 2 -3.25,-5.75; 3 -2.75,-5.75; 4 -2.25,-5.75; 5 -1.75,-5.75; 6 -1.25,-5.75; 7 -0.75,-5.75; 8 -0.25,-5.75; 9 0.25,-5.75; 10 0.75,-5.75; 11 1.25,-5.75; 12 1.75,-5.75; 13 2.25,-5.75; 14 2.75,-5.75; 15 3.25,-5.75; 16 3.75,-5.75; 33 3.75,5.75; 34 3.25,5.75; 35 2.75,5.75; 36 2.25,5.75; 37 1.75,5.75; 38 1.25,5.75; 39 0.75,5.75; 40 0.25,5.75; 41 -0.25,5.75; 42 -0.75,5.75; 43 -1.25,5.75; 44 -1.75,5.75; 45 -2.25,5.75; 46 -2.75,5.75; 47 -3.25,5.75; 48 -3.75,5.75 | smd 1.2 x 0.3: 17 5.75,-3.75; 18 5.75,-3.25; 19 5.75,-2.75; 20 5.75,-2.25; 21 5.75,-1.75; 22 5.75,-1.25; 23 5.75,-0.75; 24 5.75,-0.25; 25 5.75,0.25; 26 5.75,0.75; 27 5.75,1.25; 28 5.75,1.75; 29 5.75,2.25; 30 5.75,2.75; 31 5.75,3.25; 32 5.75,3.75; 49 -5.75,3.75; 50 -5.75,3.25; 51 -5.75,2.75; 52 -5.75,2.25; 53 -5.75,1.75; 54 -5.75,1.25; 55 -5.75,0.75; 56 -5.75,0.25; 57 -5.75,-0.25; 58 -5.75,-0.75; 59 -5.75,-1.25; 60 -5.75,-1.75; 61 -5.75,-2.25; 62 -5.75,-2.75; 63 -5.75,-3.25; 64 -5.75,-3.75
QFN-32-PAD-VIAS = smd 0.285 x 0.8: 1 -1.75,-2.5; 2 -1.25,-2.5; 3 -0.75,-2.5; 4 -0.25,-2.5; 5 0.25,-2.5; 6 0.75,-2.5; 7 1.25,-2.5; 8 1.75,-2.5; 17 1.75,2.5; 18 1.25,2.5; 19 0.75,2.5; 20 0.25,2.5; 21 -0.25,2.5; 22 -0.75,2.5; 23 -1.25,2.5; 24 -1.75,2.5 | smd 0.8 x 0.285: 9 2.5,-1.75; 10 2.5,-1.25; 11 2.5,-0.75; 12 2.5,-0.25; 13 2.5,0.25; 14 2.5,0.75; 15 2.5,1.25; 16 2.5,1.75; 25 -2.5,1.75; 26 -2.5,1.25; 27 -2.5,0.75; 28 -2.5,0.25; 29 -2.5,-0.25; 30 -2.5,-0.75; 31 -2.5,-1.25; 32 -2.5,-1.75 | smd 3.15 x 3.15: EP 0,0 | smd 0 x 0: NC1 0,0; NC2 0,0 | drill 0.4: VIA1 -0.7,-0.7; VIA2 0.7,-0.7; VIA3 0.7,0.7; VIA4 -0.7,0.7
M2-1 = drill 2.1 pad 4.4: 1 0,0
CRYSTAL-32KHZ-SMD = smd 2.5 x 6: SHEILD 0,5.08 | smd 1 x 2.5: X1 -1.27,0; X2 1.27,0

### Placement (x,y rotation side)
C1  32,9 270 top
C2  28,10.5 90 top
C3  45.5,20.75 270 top
C4  2,30.25 90 top
C5  41,18 270 top
C6  28.5,28.25 0 top
C7  24,16 0 top
C8  25.5,11.5 90 top
C9  26.5,11.5 90 top
C10  34,11 180 top
C11  36,11 0 top
C12  40.5,23 0 top
C13  36,30.75 270 top
C14  39.75,38 0 top
C15  35.25,41.25 90 top
C16  30.5,35.25 180 top
C17  37.25,41.25 90 top
C18  33.25,32 270 top
C19  32.75,40.75 90 top
C20  37,31 270 top
D1  8,46 90 top
D2  48.5,17.5 0 top
D3  49,32 90 top
D4  BAS70J  [SOD-323']  20,16 0 top
D5  43,10 90 top
DIMENSIONS1  0,0 0 top
EXB1  7,27 90 bottom
EXT1  7,27 90 top
FB1  34,10 180 top
FB2  36,10 180 top
J1  52.5,27 90 top
J4  27,47 180 top
OLPADS1  27,2.54 0 top
OLPADS2  27,51.46 0 top
Q1  30,10 90 top
Q2  34.42,46.83 0 top
R1  6.5,44 180 top
R2  50,28 270 top
R3  32,11 90 top
R4  45.5,24 90 top
R5  17,20 0 top
R6  10,39 180 top
R7  10,38 180 top
R8  11.5,18 180 top
R9  11.5,19 180 top
R10  20,24 0 top
R11  14,24 0 top
R12  20,27 0 top
R13  14,27 0 top
R14  20,30 0 top
R15  14,30 0 top
R16  20,33 0 top
R17  14,33 0 top
R18  20,36 0 top
R19  31.07,45.59 180 top
R20  23,33 90 top
R21  20,42 0 top
R22  32,47 270 top
R23  21,45 90 top
S1  14,46 0 top
SJ1  27,35.75 270 bottom
SJ2  35.25,43.75 0 bottom
SJ3  40.5,31.75 90 bottom
SJ4  29,31.75 270 bottom
SJ5  27,26.75 180 bottom
SJ6  30.5,26.75 0 bottom
SJ7  27.5,43 180 bottom
SJ8  27.5,40.75 180 bottom
SJ9  45.25,36 90 bottom
SJ10  40.5,36 90 bottom
SJ11  40.5,39.25 180 bottom
SJ12  40.5,41.25 180 bottom
SJ13  34.5,33 180 bottom
SJ14  34.5,30.5 180 bottom
SJ15  22.5,41 0 bottom
SJ16  13.25,38 0 bottom
SJ17  40,20 0 bottom
SJ18  40,16 0 bottom
SW1  48.3,23 180 top
TP1  48,9 90 top
TP2  52,37 0 top
TP3  52,17 0 top
TP4  41,4 270 top
TP5  2,17 90 top
U1  32.25,19.25 0 top
U4  34.75,36.5 0 top
X1  5.5,40.5 0 top
X2  5.5,13.5 0 top
X3  48.5,40.5 0 top
X4  48.5,13.5 0 top
Y1  23,11 90 top

### Tracks (layer width: path | path; a pad name or v marks a point on that pad's centre or on a via)
+3V3  (via drill 0.5)
  Top 0.3: C5.1 41,18.5 46.25,18.5 47.25,17.5 D2.C 47.5,17.5 48.25,16.75 51.75,16.75 TP3.P$1 | EXB1.42 v3.75,29.75 2,29.75 | EXB1.48 1.5,31.25 1.25,31 1.25,29.75 2,29.75 | 2,29.75 C4.1 | 32,47.5 31,48.5 29.75,48.5 J4.1 | 34.5,45 32.25,45 31.75,45.5 R19.1 | 34.5,45 35.25,45.75 Q2.2 35.25,46 35,46 33.5,47.5 32,47.5 | 12,18 12,19 R9.1 | v33.5,9 33.5,10 FB1.2 | v48,31 49,31 D3.1 | v12,17 12,18 | 12,18 R8.1 | v10,46 D1.A | v27.75,15.5 U1.64 | v32,32.5 33.25,32.5 | v3.75,20.75 EXT1.6 | v38.5,23.75 38.5,23 | 34.5,45 34.5,43.25 35.25,43.25 v36,42.5 | 32,47.5 R22.1
  Top 0.305: U4.2 33.5,33.23 33.25,32.98 33.25,32.5 C18.1 | 37.25,40.27 C17.1 | C6.1 v27,28.25 | U1.32 38.5,23 C12.1 | 37.25,40.27 36,40.02 U4.18 | R7.1 v11.5,38 11.5,39 R6.1 | 37.25,40.27 38,40.02 v38,40
  Top 0.406: C7.1 23,16 v22.75,15.75
  Bottom 0.3: SJ3.1 40.5,20 | v27,28.25 26.75,28 26.75,26.75 SJ5.1 | v29,33.5 SJ4.1 | v27,37.5 SJ1.1 | v36,42.5 36,43.75 SJ2.1 | v3.75,20.75 EXT1.6 | v3.75,29.75 EXB1.42 | EXB1.48 3.75,31.25 v3.75,31.5 | 40.5,20 40.75,19.75 40.75,17.75 42.25,16.25 42.25,15.75 40.5,14 38.5,14 v38.5,23.75 | 40.5,20 SJ17.1
  Bottom 0.305: v11.5,38 SJ16.2
  pour Layer3: -2,56 56,56 56,-2 -2,-2
+5V  (via drill 0.5)
  Top 0.3: EXT1.8 v6.75,21.25 | 41.25,6.5 41.25,4 TP4.P$1 39.75,4 38.5,2.75 OLPADS1.10 | 41.25,6.5 41.25,7.5 D5.1 | v12,12.25 12,6.5 41.25,6.5
  Layer2 0.3: v6.75,21.25 6.75,17.5 v12,12.25
  Bottom 0.3: v6.75,21.25 EXT1.8
-RTS
  Top 0.1: C3.2 45.5,20.25 46.25,19.5 47.5,19.5 SW1.3
A0  (via drill 0.3)
  Top 0.1: U1.14 35,12.25 v34.75,12.25 | v32.75,7.5 15.75,7.5 v13,10.25 | v7.5,22.25 EXB1.11
  Bottom 0.1: v34.75,12.25 34.25,12.75 32.75,12.75 v32.75,7.5 | v13,10.25 11,12.25 11,21.5 10.5,22 9.75,22 9.5,22.25 EXB1.11 v7.5,22.25
A1  (via drill 0.3)
  Top 0.1: U1.16 36.25,13.25 v36.75,13.25 | EXB1.9 10,21.75 v10.25,21.5
  Bottom 0.1: v36.75,13.25 36.75,5.25 34.25,2.75 34.25,1.75 33.5,1 15,1 15,1.25 12.75,3.5 12.75,9.75 10.75,11.75 10.75,21 v10.25,21.5 10,21.75 EXB1.9
A2  (via drill 0.3)
  Top 0.1: U1.20 35.75,17 35.25,17.5 34.5,17.5 v34.25,17.25 | v12.5,20.75 12.25,21 10.25,21 | 10.25,21 9.75,21 9.5,21.25 EXB1.7 | 10.25,21 v10.25,20.75
  Bottom 0.1: v34.25,17.25 34.25,16.5 36.25,14.5 36.25,7.75 36.5,7.5 36.5,7 33.5,4 13.5,4 13.5,18.25 12.5,19.25 v12.5,20.75 | EXB1.7 9.75,21.25 v10.25,20.75
A3  (via drill 0.3)
  Top 0.1: U1.21 38.75,17.5 39.25,18 39.75,18 40.25,17.5 40.25,7.25 v36,7.25 | v13.25,20 13,20.25 10,20.25 9.5,20.75 EXB1.5 v7.5,20.75
  Bottom 0.1: v36,7.25 33,4.25 14,4.25 14,19.25 v13.25,20 | v7.5,20.75 EXB1.5
A4  (via drill 0.3)
  Top 0.1: 10.75,19.25 v10.25,19.75 10,20 9.75,20 9.5,20.25 EXB1.3 | 10.75,19.25 11,19 R9.2 | U4.27 28.25,37.25 27.25,38.25 v24,38.25 | v24.75,17 25.25,16.5 U1.62 | 10.75,19.25 11,19.5 14.25,19.5 15.25,18.5 v21.5,18.5
  Bottom 0.1: EXB1.3 10.25,20.25 v10.25,19.75 | v24,38.25 23.75,38 23.75,34.5 23.25,34 23.25,25 23.75,24.5 23.75,18 | v24.75,17 23.75,18 | v21.5,18.5 22,18 22,15.5 23,14.5 23.75,14.5 23.75,18
A5  (via drill 0.3)
  Top 0.1: 9.75,19.25 9.25,19.75 EXB1.1 | 9.75,19.25 11,18 R8.2 | 9.75,19.25 v9.5,19 | v23.25,36.75 U4.28 | U1.58 v23.25,18.5 | v23.25,15 v10.25,15
  Bottom 0.1: EXB1.1 9,19.75 9.5,19.25 v9.5,19 10.25,18.25 v10.25,15 | v23.25,36.75 23.25,34.5 23,34.25 23,24.75 23.5,24.25 23.5,18.75 | v23.25,18.5 23.5,18.75 | v23.25,15 23.5,15.25 23.5,18.75
AREF  (via drill 0.5)
  Top 0.3: 10.25,22.5 10,22.75 EXT1.13 | 10.25,22.5 11.25,21.5 14.5,21.5 16,20 R5.1 | 10.25,22.5 v10.5,22.75
  Bottom 0.3: v10.5,22.75 EXT1.13
BOOT0  (via drill 0.3)
  Top 0.1: 45.5,24.5 46.75,25.75 48,25.75 48.75,26.5 SW1.1 | U1.60 23.5,17.5 21.75,15.75 21.75,15.25 10.75,15.25 10.5,15.5 8.5,15.5 v8.25,15.25 | EXB1.44 6,30.25 v6.5,29.75 | 45.5,24.5 45.25,24.25 v44.25,24.25 | v12.25,5.75 v37.5,5.75 | 45.5,24.5 R4.2
  Bottom 0.1: v6.5,29.75 6,30.25 EXB1.44 4.25,30.25 4,30.5 3.5,30.5 2.75,29.75 2.75,19.75 7.25,15.25 v8.25,15.25 8.25,9.75 v12.25,5.75 | v44.25,24.25 43.5,23.5 43.5,11.75 v37.5,5.75
BOOT0TX
  Top 0.1: R2.1 50,28.5 50.25,28.25 50.5,28.25 52.5,26.25 J1.TXD 52.5,25.5 53.25,25.5 53.25,20.5 52.75,20 49.5,20 49,19.5 SW1.4
CSSPIN  (via drill 0.3)
  Top 0.1: U4.8 38.75,34 39.75,33 39.75,31 39,31 v38.5,30.5 | v38.5,24.75 36,22.25 28.25,22.25 27,21 U1.53
  Bottom 0.1: v38.5,24.75 v38.5,30.5
D0  (via drill 0.3)
  Top 0.1: v3.75,25.25 EXB1.24 | R2.2 50,27.5 49.75,27.75 49,27.75 47.75,29 31.75,29 31,28.25 U1.43 v31,23.75
  Layer2 0.1: v3.75,25.25 7.25,28.75 14.25,28.75 18.25,32.75 24.25,32.75 25.5,31.5 25.5,26.75 28,24.25 30.5,24.25 v31,23.75
  Bottom 0.1: EXB1.24 v3.75,25.25
D1  (via drill 0.3)
  Top 0.1: v6.5,25.75 EXB1.26 | v46.75,27 46.25,27.5 31.5,27.5 U1.42 31.5,24.5 31.75,24.25 v31.75,23.75
  Layer2 0.1: v6.5,25.75 20,25.75 24.75,21 29.25,21 31.75,23.5 v31.75,23.75
  Bottom 0.1: EXB1.26 v6.5,25.75 | v46.75,27 51.75,27 51.75,24 52.5,23.25 J1.RXD
D2  (via drill 0.3)
  Top 0.1: v27.75,20.5 U1.54 | v7.5,26.25 EXB1.28
  Layer3 0.1: v27.75,20.5 27.5,20.75 16.25,20.75 11.25,25.75 8,25.75 v7.5,26.25
  Bottom 0.1: EXB1.28 v7.5,26.25
D3  (via drill 0.3)
  Top 0.1: EXB1.30 v3.75,26.75 2.25,25.25 v2.25,19 | U1.44 30.5,22.75 35.25,22.75 39,26.5 v44,26.5 | v3,11.75 8.5,6.25 11,6.25 12,5.25 v38,5.25
  Bottom 0.1: EXB1.30 v3.75,26.75 | 44.75,26.5 46.25,26.5 46.25,27.25 46.75,27.75 51.75,27.75 51.75,30 52.5,30.75 J1.-CTS | 44.75,26.5 v44,26.5 | v2.25,19 1,17.75 1,15 2.75,13.25 2.75,12 v3,11.75 | v38,5.25 44.75,12 44.75,26.5
D4  (via drill 0.3)
  Top 0.1: v6.5,27.25 EXB1.32 | C3.1 45.5,21.25 45.75,21 52.25,21 52.5,20.75 J1.-RTS | 30,23 30,22.5 35.5,22.5 38.25,25.25 v45.25,25.25 | 30,23 U1.45 | 30,23 v28.75,23
  Layer2 0.1: v6.5,27.25 7,27.75 9.5,27.75 10,28.25 12.25,28.25 13.75,26.75 17.5,26.75 17.75,26.5 24,26.5 24.25,26.75 25,26.75 v28.75,23
  Bottom 0.1: EXB1.32 v6.5,27.25 | v45.25,25.25 48,25.25 52.5,20.75 J1.-RTS
D5  (via drill 0.3)
  Top 0.1: v32.75,20.5 U1.27 | v29.5,23.75 29.25,23.5 23.25,23.5 23,23.25 16,23.25 15.75,23 v11.75,23 | v10.75,27.25 EXB1.31
  Bottom 0.1: v29.5,23.75 v32.75,20.5 | v11.75,23 11.75,26 10.5,27.25 | EXB1.31 10.5,27.25 | 10.5,27.25 v10.75,27.25
D6  (via drill 0.3)
  Top 0.1: U1.17 37.5,15 v34.25,15 | v12.75,25.25 11.25,26.75 v10.25,26.75 EXB1.29
  Bottom 0.1: v34.25,15 34,14.75 34,14.5 27,7.5 14.25,7.5 14.25,23 12.75,24.5 v12.75,25.25 | v10.25,26.75 EXB1.29
D7  (via drill 0.3)
  Top 0.1: v11.25,24 R11.1 13.25,24 14.25,25 17,25 v17.25,25.25 | v27,39 26.75,39.25 18.5,39.25 v18,38.75 | v10.75,26.25 EXB1.27
  Bottom 0.1: v11.25,24 11.25,25.5 10.5,26.25 | EXB1.27 10.5,26.25 | v27,39 27,40.5 26.75,40.75 SJ8.1 | v18,38.75 17.75,38.5 17.75,27.5 17.25,27 v17.25,25.25 | 10.5,26.25 v10.75,26.25
D8  (via drill 0.3)
  Top 0.1: U1.59 14.5,18 v13.5,19 | EXB1.25 8,25.75 7.5,25.25 v7.5,25
  Layer3 0.1: v13.5,19 10.5,22 10.25,22 8,24.25 8,24.5 v7.5,25
  Bottom 0.1: v7.5,25 7.75,25.25 7.75,25.5 8,25.75 EXB1.25
D9  (via drill 0.3)
  Top 0.1: 18.5,27.5 18.25,27.75 12.5,27.75 v12,27.25 | 18.5,27.5 19,27 R12.1 | v18.75,38.75 v26.25,38.75 | 18.5,27.5 v18,27 | v10.75,25.25 EXB1.23
  Bottom 0.1: v12,27.25 12.25,27 12.25,22.75 12,22.5 11.25,22.5 11.25,23.25 10.75,23.75 10.75,25 10.5,25.25 | EXB1.23 10.5,25.25 | v26.25,38.75 26.25,42.5 26.75,43 SJ7.1 | v18.75,38.75 18,38 v18,27 | 10.5,25.25 v10.75,25.25
D10  (via drill 0.3)
  Top 0.1: EXB1.21 v10.25,24.75 13.5,24.75 14.5,25.75 21,25.75 21.25,25.5 23.75,25.5 v24.5,26.25 | U4.1 32.5,33.5 30,33.5 29.25,34.25 27.5,34.25 v27,33.75 | U1.50 v24.5,22.5 | J4.6 27,44 v26.25,44
  Bottom 0.1: EXB1.21 v10.25,24.75 | 25,31.75 24.5,31.25 v24.5,26.25 v24.5,22.5 | 25,31.75 v27,33.75 | v26.25,44 24.75,44 24.75,36.25 25,36 25,31.75
D11  (via drill 0.3)
  Top 0.1: v7.5,24.25 EXB1.19 10.5,24.25 10.75,24 10.75,23.5 12.25,23.5 12.5,23.25 15.5,23.25 16,23.75 16,24.75 v17.75,24.75 | U4.17 37,39.5 v37.25,39.5 | U1.57 v19.25,19
  Bottom 0.1: v7.5,24.25 EXB1.19 | v37.25,39.5 37.25,45.75 34,49 20.5,49 20.5,30.25 19.25,29 19.25,24.75 | v19.25,19 19.25,24.75 | 19.25,24.75 v17.75,24.75
D12  (via drill 0.3)
  Top 0.1: v10.25,23.75 EXB1.17 | U4.10 38.5,35.25 v41.75,32 | v41.5,19.75 41,19.25 39.75,19.25 38.5,18 U1.22 29.25,18 v28.5,18.75
  Layer2 0.1: v10.25,23.75 11.25,24.75 17,24.75 21.25,20.5 26.75,20.5 v28.5,18.75
  Bottom 0.1: EXB1.17 v10.25,23.75 | v41.75,32 41.5,31.75 v41.5,19.75
D13  (via drill 0.3)
  Top 0.1: v7.5,23.25 EXB1.15 | U4.9 37.75,34.25 39,34.25 40,33.25 40,30.5 v39.25,30.5 | v32.25,19.25 27.75,19.25 27,20 U1.55 26,20 25.25,20.75 17.25,20.75 17.25,19.75 16.75,19.25 15.5,19.25 15,19.75 14.25,19.75 v13.25,20.75
  Layer2 0.1: v7.5,23.25 9,23.25 10.25,22 12,22 v13.25,20.75
  Bottom 0.1: EXB1.15 v7.5,23.25 | v39.25,30.5 38.75,31 37.75,31 37.75,24.75 v32.25,19.25
DONE  (via drill 0.3)
  Top 0.1: v33.5,40.25 U4.23
  Layer3 0.1: v33.5,40.25 33.25,40 v29,40
  Bottom 0.1: v29,40 28.25,40.75 SJ8.2
DOUT
  Top 0.1: TP1.P$1 46,9 44.75,7.75 D5.2
E0  (via drill 0.3)
  Top 0.1: v12,30.5 12.5,30.5 13,30 R15.1 13.25,30 14,30.75 15.5,30.75 16.25,30 17.5,30 v18.5,29 | v43.75,37 43.75,49.25 36,49.25 v35,50.25 | v10.25,27.75 EXB1.33
  Bottom 0.1: v12,30.5 12.5,30 12.5,29.5 10.75,27.75 v10.25,27.75 EXB1.33 | v43.75,37 43.75,35.25 45.25,35.25 SJ9.1 | v35,50.25 34,50.25 33.75,50 19.25,50 19.25,37.75 18.5,37 v18.5,29
E1  (via drill 0.3)
  Top 0.1: v16,33.25 18.75,33.25 19,33 R16.1 | v22.75,46.25 21.5,45 v16.25,45 | v7.5,28.25 EXB1.35
  Layer2 0.1: v16,33.25 12.5,29.75 v12,29.75
  Bottom 0.1: v12,29.75 10.75,29.75 10.75,29.5 9.5,28.25 EXB1.35 v7.5,28.25 | v22.75,46.25 22.75,48.75 33.75,48.75 37,45.5 37,40.75 36.75,40.5 36.75,39 38.5,39 39.25,38.25 39.25,36.5 40.5,35.25 SJ10.1 | v16.25,45 16,44.75 v16,33.25
E2  (via drill 0.3)
  Top 0.1: 12.25,33.75 13,33 R17.1 | v10.5,33.75 12.25,33.75 | v7.5,30.25 7,29.75 7,28.75 EXB1.37 | v37.5,46.25 33.75,50 17.25,50 v17,50.25 | v16.75,34.5 16,33.75 12.25,33.75
  Layer3 0.1: v10.5,33.75 7.5,30.75 v7.5,30.25
  Bottom 0.1: v37.5,46.25 37.5,41.5 39.75,39.25 SJ11.1 | v17,50.25 16.75,50 v16.75,34.5 | EXB1.37 7,28.75 7,29.75 v7.5,30.25
E3  (via drill 0.3)
  Top 0.1: v7.5,29.25 EXB1.39 | v19.25,37 19.25,36 R18.1
  Layer2 0.1: v7.5,29.25 10.5,29.25 11.5,30.25 11.5,30.75 17.75,37 v19.25,37
  Bottom 0.1: EXB1.39 v7.5,29.25 | v19.25,37 19.5,37.25 19.5,49.75 39.75,49.75 39.75,41.25 SJ12.1
E4  (via drill 0.3)
  Top 0.1: v32,14.75 U1.8 | v26,28 25.75,28.25 11,28.25 9.75,29.5 | 9.75,29.5 9.5,29.75 EXB1.41 | v10.25,29.75 10,29.5 9.75,29.5
  Bottom 0.1: v32,14.75 31.75,15 31.75,18 26,23.75 v26,28 | v10.25,29.75 EXB1.41
E5  (via drill 0.3)
  Top 0.1: U1.9 32.5,14.75 v32.75,14.75 | v19.75,28.75 19.5,28.5 12.25,28.5 10.5,30.25 | EXB1.43 10.5,30.25 | 10.5,30.25 v10.75,30.25
  Bottom 0.1: v32.75,14.75 27.25,9.25 19.75,9.25 v19.75,28.75 | v10.75,30.25 EXB1.43
E6  (via drill 0.3)
  Top 0.1: U1.10 33,14.25 v33.5,14.75 | v17.25,31 11.25,31 11,30.75 v10.25,30.75 EXB1.45
  Bottom 0.1: v33.5,14.75 27.75,9 17.5,9 17.5,24.25 16.75,25 16.75,29.75 17.25,30.25 v17.25,31 | v10.25,30.75 EXB1.45
E7  (via drill 0.3)
  Top 0.1: U1.11 33.5,12.75 31.5,12.75 31,12.25 27,12.25 26.5,12.75 v25.25,12.75 | v24,30 23,31 18,31 17.5,31.5 10.75,31.5 | 10.75,31.5 9.75,31.5 9.5,31.25 EXB1.47 | 10.75,31.5 v10.75,31.25
  Bottom 0.1: v25.25,12.75 25.25,18.5 24,19.75 v24,30 | v10.75,31.25 EXB1.47
E8  (via drill 0.3)
  Top 0.1: U1.24 33.25,19 32.5,19.75 v28.5,19.75 | v25,23 16.25,23 15.75,22.5 v15.25,22.5 | v14,32.25 13.5,31.75 EXB1.49 v7.5,31.75
  Bottom 0.1: v28.5,19.75 25.75,19.75 25.75,22.25 v25,23 | v15.25,22.5 15,22.75 15,31.25 v14,32.25 | v7.5,31.75 EXB1.49
E9  (via drill 0.3)
  Top 0.1: U1.25 33.25,19.5 32.75,20 29,20 v28.5,20.5 | v11,32.25 EXB1.51
  Layer3 0.1: v28.5,20.5 27,22 17.5,22 12.5,27 12.5,30.75 v11,32.25
  Bottom 0.1: EXB1.51 v11,32.25
E10  (via drill 0.3)
  Top 0.1: U1.37 34,23.25 v34.75,23.25 | v10.25,32.75 EXB1.53
  Layer3 0.1: v34.75,23.25 34.75,21 v21.75,8
  Bottom 0.1: v21.75,8 14.5,8 14.5,23.25 14.75,23.5 14.75,26.25 14.25,26.75 12.75,26.75 12.75,31.25 11.25,32.75 v10.25,32.75 EXB1.53
E11  (via drill 0.3)
  Top 0.1: U1.38 33.5,23.75 v32.5,23.75 | v11.5,33.25 EXB1.55
  Layer3 0.1: v32.5,23.75 31.25,22.5 27.5,22.5 26,24 26,25.75 20,31.75 13,31.75 v11.5,33.25
  Bottom 0.1: EXB1.55 v11.5,33.25
E12  (via drill 0.3)
  Top 0.1: R7.2 9.5,38 v9.5,37.25 v10.75,37.25 | v16.75,30.5 18.5,30.5 19,30 R14.1 | v29.75,34.5 25.25,34.5 24.75,35 v12.25,35 10.75,35 9.5,33.75 EXB1.57
  Bottom 0.1: v9.5,37.25 10,36.75 10,34.25 9.5,33.75 EXB1.57 | v16.75,30.5 v12.25,35 10.75,36.5 v10.75,37.25 | SJ13.1 32.5,33 32,33.5 29.75,33.5 v29.75,34.5
E13  (via drill 0.3)
  Top 0.1: v8.75,38.25 9.5,39 R6.2 | v14,27.25 13.5,27.25 13.25,27 R13.1 | v32.5,31.25 32,31.75 31,31.75 30.5,32.25 v24,32.25 | v10.5,35.5 10.25,35.5 9,34.25 EXB1.59
  Layer2 0.1: v24,32.25 19.25,27.5 14.25,27.5 v14,27.25
  Bottom 0.1: v8.75,38.25 9,38 9,37.75 | 9,37.75 9,36 9.25,35.75 9.25,34.5 9,34.25 EXB1.59 | v14,27.25 13.75,27.5 13.75,31.75 10.25,35.25 10.25,35.5 | 10.25,35.5 10.25,37.25 9.75,37.75 9,37.75 | v32.5,31.25 33.25,31.25 33.75,30.75 33.75,30.5 SJ14.1 | 10.25,35.5 v10.5,35.5
E14  (via drill 0.3)
  Top 0.1: U1.33 36,27 v36.25,27 | v28.25,35.25 14,35.25 12.5,36.75 5.75,36.75 4.75,35.75 4.75,35 | 4.75,35 4.75,34.25 EXB1.60 | 4.75,35 v4.5,35
  Layer2 0.1: v36.25,27 36.25,29 33,32.25 33,36.25 31,38.25 29.75,38.25 28.25,36.75 v28.25,35.25
  Bottom 0.1: v4.5,35 4.5,34.75 5,34.25 EXB1.60
E15  (via drill 0.3)
  Top 0.1: U1.36 34.5,24.25 36.25,24.25 39,27 v42.5,27 | v44.5,34.25 44.5,36 44.75,36.25 44.75,49.5 42.25,49.5 38.75,53 v37.75,53 | v3.75,33.75 EXB1.58
  Bottom 0.1: v42.5,27 44.5,29 v44.5,34.25 | v37.75,53 16.5,53 16.5,47.75 4,35.25 4,34.25 | 4,34.25 4.5,33.75 EXB1.58 | v3.75,33.75 4,34 4,34.25
E16  (via drill 0.3)
  Top 0.1: U1.35 35,27 v34.25,27 | v7.5,34.25 6.5,33.25 EXB1.56
  Layer3 0.1: v34.25,27 30.75,30.5 22.5,30.5 19,34 11,34 10.75,34.25 v7.5,34.25
  Bottom 0.1: EXB1.56 7.5,33.25 v7.5,34.25
E17  (via drill 0.3)
  Top 0.1: v35.5,27 U1.34 | v30,37.75 28.25,39.5 8.5,39.5 6,37 5.5,37 3.25,34.75 3.25,32.75 v3.75,32.75 EXB1.54
  Layer2 0.1: v35.5,27 35.5,29.25 32.75,32 32.75,35 v30,37.75
  Bottom 0.1: v3.75,32.75 EXB1.54
E18  (via drill 0.3)
  Top 0.1: v23,21.5 U1.52 | v23.75,40 23.5,39.75 8.25,39.75 6,37.5 5.5,37.5 3,35 3,32.25 v3.25,32.25 EXB1.52
  Bottom 0.1: v23,21.5 22,22.5 22,35.5 21.75,35.75 21.75,38 v23.75,40 | v3.25,32.25 EXB1.52
E19  (via drill 0.3)
  Top 0.1: U1.51 14,22 v13.5,22.5 | v6.5,31.75 EXB1.50
  Layer3 0.1: v13.5,22.5 11.5,24.5 10.75,24.5 10.5,24.25 9,24.25 7.5,25.75 7.25,25.75 6,27 6,31.25 v6.5,31.75
  Bottom 0.1: EXB1.50 v6.5,31.75
ETH_INT  (via drill 0.3)
  Top 0.1: U1.15 35.5,12.75 v37.25,12.75 | v37,4.25 36.75,4 11.5,4 v9.75,5.75 | 4,27.75 v2.25,26 | EXB1.34 4,27.75 | 4,27.75 v3.75,27.75
  Bottom 0.1: v37.25,12.75 37,12.5 v37,4.25 | v9.75,5.75 3,12.5 3,19 2.25,19.75 v2.25,26 | v3.75,27.75 EXB1.34
ETH_RX+  (via drill 0.3)
  Top 0.1: v3.75,28.75 EXB1.38
  Bottom 0.1: EXB1.38 v3.75,28.75
ETH_RX-  (via drill 0.3)
  Top 0.1: EXB1.40 6,29.25 v6.5,28.75
  Bottom 0.1: v6.5,28.75 6,29.25 EXB1.40
ETH_SS  (via drill 0.3)
  Top 0.1: U1.2 29,15 29.25,15.25 v30,15.25 | v20.25,12.75 20,13 8.5,13 6.5,11 4.5,11 1.5,14 1.5,16 0.75,16.75 0.75,28.25 v3.25,28.25 EXB1.36
  Bottom 0.1: v30,15.25 28.75,15.25 28.75,15 25.75,12 20.25,12 v20.25,12.75 | v3.25,28.25 EXB1.36
GNDI  (via drill 0.5)
  Top 0.3: 19.25,42.25 17.5,44 S1.1 S1.2 10.5,44 9.75,43.25 6,43.25 6,44 R1.2 | 19.25,42.25 19.5,42 | 19.25,42.25 21,44 R23.1 | 42,16.5 45,13.5 45,12.5 44.75,12.5 D5.3 | 42,16.5 41,17.5 C5.2 | 26.5,11 25.5,11 C8.1 | 28,10 29,9 Q1.4 | 28,10 31,10 | 31,10 31.5,10 32,9.5 C1.1 | 26.5,11 26.5,10 v27,10 28,10 | 26.5,11 C9.1 | 28,10 C2.1 | 31,10 31,11 Q1.2 | 41.75,23.5 v42.75,23.5 45.5,23.5 R4.1 | 41.75,23.5 41.5,23.5 41,23 C12.2 | U1.31 39.5,22.5 39.75,22.25 40.5,22.25 41.75,23.5 | C4.2 2,30.75 EXB1.46 v6.75,30.75 | 25.5,47.5 26.25,47.5 27,48.25 J4.5 | 25.5,47.5 24.5,47.5 24.5,48.5 J4.9 | EXT1.14 5.25,22.75 5.25,22.25 EXT1.12 v3.75,22.25 | v35.5,9 35.5,10 FB2.2 | v24,33.75 23,33.75 R20.2 | 34,37 34,36 | 34,36 34,35 | 34,37 34,38 | 34,37 U4.EP | 32.75,41.75 35.25,41.75 C15.2 | v24.5,15 24.5,16 | v25.5,47.25 25.5,47.5 | v41.5,16 42,16.5 | 19.5,42 19.5,40.75 32,40.75 32.5,41.25 32.75,41.25 | 19.5,42 R21.1 | 34,36 U4.EP | 34,36 U4.VIA1 U4.VIA4 | U4.VIA2 U4.VIA3 35.45,36.5 U4.EP
  Top 0.305: U4.22 34,38 | U4.3 34,35 | U4.EP 34.5,36.5 34,37 | C19.2 32.75,41.25 32.75,41.75 v32.75,42 | C20.2 v37,29.75 36,29.75 C13.2 | C16.2 v29.25,35.25 | C6.2 v30.25,28.25 | U1.63 24.5,16 C7.2 | C18.2 33.25,30.75 v33,30.5 | C14.2 v41,38 | C17.2 C15.2
  Top 0.406: v30.25,28.25 30,28.5 30,29.5 31,30.5 v33,30.5
  Bottom 0.3: EXT1.14 5.25,22.75 5.25,22.25 EXT1.12 v3.75,22.25 | v41.5,16 SJ18.1 | v30.25,28.25 30.75,27.75 30.75,26.75 SJ6.1 | v6.75,30.75 EXB1.46
  pour Layer2: -1,55 55,55 55,-1 -1,-1
JTAGEN_GATE
  Top 0.1: 32,46.5 32.5,46 33.25,46 Q2.1 | 32,46.5 31.75,46.75 30,46.75 28.25,48.5 J4.3 | 32,46.5 R22.2
JTAGENB  (via drill 0.3)
  Top 0.1: R21.2 v21.25,42 29.5,42 v30,41.5 | v30.75,37.75 U4.26 | v33.5,48.25 34,48.25 34.25,48 Q2.3
  Bottom 0.1: SJ15.2 21.75,41 21.75,41.5 v21.25,42 24.5,45.25 24.5,48.25 v33.5,48.25 | v30.75,37.75 30,38.5 v30,41.5
JTAGENB_MCU  (via drill 0.3)
  Top 0.1: U1.56 27,19.5 v27.75,18.75
  Bottom 0.1: v27.75,18.75 28.5,18 28.5,15.25 25.5,12.25 21.25,12.25 21.25,18 21,18.25 21,38.75 23.25,41 SJ15.1
JTDI  (via drill 0.3)
  Top 0.1: v32.25,34 U4.32 | v33.25,26.5 32.5,25.75 U1.40 | v30.25,43.5 30,43.25 29.25,43.25 29,43.5 25.75,43.5 25.75,45.25 J4.8
  Bottom 0.1: v33.25,26.5 33.25,27 36.75,30.5 36.75,34 v32.25,34 32.25,41.5 v30.25,43.5
MCO  (via drill 0.3)
  Top 0.1: U4.21 34.5,39.75 v34.25,40 | v32,26.25 U1.41
  Layer2 0.1: v32,26.25 32.75,26.25 33.25,25.75 36.25,25.75 38,27.5 38,32.75 36,34.75 36,38.25 v34.25,40
N41567
  Top 0.1: R1.1 7,44 7,46 D1.C
N205481
  Top 0.1: 31.75,8.75 32,8.5 C1.2 | 31.75,8.75 31,8.75 Q1.1 | 31.75,8.75 32.5,8.75 32.5,10 32,10.5 R3.1
N$5  (via drill 0.3)
  Top 0.1: v14,24 R11.2 | v27.75,17.75 27,17 U1.61
  Layer2 0.1: v14,24 15.25,24 21.5,17.75 v27.75,17.75
N$6
  Top 0.1: R23.2 21,46 19.75,47.25 8.25,47.25 8,47.5 8,48.5 8.75,48.5 10,49.75 24.75,49.75 25.75,48.75 J4.7
N$7  (via drill 0.3)
  Top 0.1: v27.5,25.5 26.25,26.75 21.25,26.75 21,27 R12.2 | U1.26 v36.25,20
  Bottom 0.1: v27.5,25.5 29,24 29,23.5 31.75,20.75 31.75,19 32,18.75 36.25,18.75 v36.25,20
N$9  (via drill 0.3)
  Top 0.305: U4.11 43.5,35.75 v44.25,36.5
  Bottom 0.1: v44.25,36.5 44.25,36.75 45.25,36.75 SJ9.2
N$10  (via drill 0.3)
  Top 0.305: U4.12 42.5,36.25 v42.75,36.5
  Bottom 0.1: v42.75,36.5 42.75,36.75 40.5,36.75 SJ10.2
N$12  (via drill 0.3)
  Top 0.1: U4.20 35,39.5 34.75,39.75 34.75,41 v33.5,41
  Bottom 0.1: SJ7.2 28.25,43 28.25,44.25 31.5,44.25 33.5,42.25 v33.5,41
N$15  (via drill 0.3)
  Top 0.305: U4.13 42,36.75 v42.5,37.25
  Bottom 0.1: v42.5,37.25 42.5,38 41.25,39.25 SJ11.2
N$16  (via drill 0.3)
  Top 0.15: 37.75,37.25 41.5,37.25 42,37.75 v42,40
  Top 0.305: U4.14 37.75,37.25
  Bottom 0.1: v42,40 42,40.5 41.25,41.25 SJ12.2
N$17  (via drill 0.3)
  Top 0.305: U4.4 34.5,32.5 v34.25,31.75
  Bottom 0.1: v34.25,31.75 34.25,32 35.25,33 SJ13.2
N$20  (via drill 0.3)
  Top 0.305: U4.5 v35,31.75
  Bottom 0.1: v35,31.75 35,30.75 35.25,30.5 SJ14.2
NRES  (via drill 0.3)
  Top 0.1: 45,20 45.25,19.75 45.5,19.75 46.75,18.5 49.5,18.5 50.5,19.5 53.5,19.5 53.5,28.5 49,33 D3.2 v49,34 | 45,20 45,23 46.5,23 49.5,26 49.5,27.5 48.5,27.5 47.75,26.75 SW1.2 | U1.7 31.5,15 v31.25,15 | v42.5,19.25 43.25,20 45,20 | J4.10 24.25,45.5 21.75,48 S1.3 S1.4 8.75,48 v8.5,47.75 | v6.5,24.75 EXB1.22 3.5,24.75 2.75,24 2.75,18.5 2,18.5 v1.5,19
  Layer2 0.1: v31.25,15 35.5,19.25 v42.5,19.25
  Bottom 0.1: EXB1.22 v6.5,24.75 | v1.5,19 1.75,19.25 1.75,40.5 8.5,47.25 v8.5,47.75 9.75,47.75 15,53 15.5,53 16,53.5 38,53.5 38.25,53.25 38.5,53.25 43.5,48.25 43.5,39.5 v49,34
OSC32_IN  (via drill 0.3)
  Top 0.1: 25,12.25 23,12.25 Y1.X2 | 25,12.25 25.25,12.25 25.5,12 C8.2 | v29.5,14.75 U1.3 | 25,12.25 v25,10.25
  Bottom 0.1: v25,10.25 v29.5,14.75
OSC32_OUT  (via drill 0.3)
  Top 0.1: v27.25,11.75 26.75,11.75 26.5,12 C9.2 | v25.75,10.25 25.25,9.75 23,9.75 Y1.X1 | U1.4 30,14.75 v30.5,14.75
  Bottom 0.1: v25.75,10.25 v27.25,11.75 27.5,11.75 v30.5,14.75
PA7
  Top 0.1: U1.23 38.5,18.5 40.25,20.25 41.75,20.25 42,20 42,19 40.5,19 40.5,12.5 41.25,12.5 D5.4
PB10  (via drill 0.3)
  Top 0.1: v21.5,26 16,26 15,27 R13.2 | v29,21.5 29.25,21.25 37.25,21.25 37.5,21.5 U1.29
  Layer2 0.1: v21.5,26 23.75,26 28.25,21.5 v29,21.5
PB11  (via drill 0.3)
  Top 0.1: v26.5,29.5 21.5,29.5 21,30 R14.2 | v33,21.75 33.25,22 U1.30
  Bottom 0.1: v26.5,29.5 28.5,29.5 29,30 30.75,30 30.75,28.75 31.25,28.25 31.25,27.75 33,26 v33,21.75
PF0  (via drill 0.3)
  Top 0.1: 28,11 29,11 Q1.3 | U1.5 30.5,12.75 28.25,12.75 27.5,13.5 21,13.5 v20.75,13.25 | 28,11 v27.25,11 | 28,11 C2.2
  Layer2 0.1: v20.75,13.25 24,13.25 26.25,11 v27.25,11
PF1
  Top 0.1: U1.6 31,12.75 30.75,12.5 28,12.5 27.25,13.25 21.5,13.25 21.5,9.25 22.75,8 32.75,8 32.75,11 32.5,11.25 32.25,11.25 32,11.5 R3.2
PF4  (via drill 0.5)
  Top 0.3: v16,29.25 15.75,29.25 15,30 R15.2 | v16,14.25 27.75,14.25 29.5,16 U1.18 39.5,16 v39.5,14.75
  Bottom 0.3: v16,14.25 v16,29.25 | v39.5,14.75 39.5,16 SJ18.2
PF5  (via drill 0.5)
  Top 0.3: R16.2 28.5,33 28.75,32.75 v31,32.75 | v39.25,28.25 v32,28.25 | U1.19 38.75,16.5 v39.5,17.25
  Bottom 0.3: v31,32.75 31.25,32.5 31.25,29 v32,28.25 | v39.25,28.25 39.25,20.25 39.5,20 | 39.5,20 v39.5,17.25 | 39.5,20 SJ17.2
PF6  (via drill 0.5)
  Top 0.3: v29.25,29.25 27,31.5 19.75,31.5 19.25,32 16,32 15,33 R17.2
  Top 0.305: U1.47 v29,27
  Bottom 0.3: v29.25,29.25 29,29 v29,27 29,26.75 SJ6.2
PF7  (via drill 0.5)
  Top 0.3: 22.75,24.75 28.25,24.75 U1.48 | 22.75,24.75 21.75,24.75 21,24 R10.2 | v22.5,36 R18.2 | 22.75,24.75 v22.75,24
  Top 0.305: U1.48 28.5,26 v28.25,26.25
  Bottom 0.3: v22.5,36 22.5,24.25 v22.75,24 | SJ5.2 28.25,26.75 v28.25,26.25
PROGRAMN  (via drill 0.3)
  Top 0.1: U4.25 31.25,38.25 v30.5,39 | v34.5,26.25 34,25.75 33.25,25.75 33,25.5 U1.39
  Layer2 0.1: v30.5,39 31.25,39.75 32.25,39.75 34.75,37.25 34.75,34.75 37.5,32 37.5,30.25 37.75,30 37.75,27.75 36,26 34.75,26 v34.5,26.25
RSV0  (via drill 0.3)
  Top 0.1: v3.75,24.25 EXB1.20
  Bottom 0.1: EXB1.20 v3.75,24.25
RSV1  (via drill 0.3)
  Top 0.1: v6.5,23.75 EXB1.18
  Bottom 0.1: EXB1.18 v6.5,23.75
RSV2  (via drill 0.3)
  Top 0.1: v3.75,23.25 EXB1.16
  Bottom 0.1: EXB1.16 v3.75,23.25
SN  (via drill 0.3)
  Top 0.1: U4.16 39.5,40.5 v42.5,40.5 | v42,22.75 40.25,21 U1.28
  Bottom 0.1: v42.5,40.5 43.25,39.75 43.25,28.5 42,27.25 v42,22.75
SWCLK  (via drill 0.3)
  Top 0.1: 20.25,32.25 23,32.25 R20.1 | 20.25,32.25 20.25,34.5 v24.5,34.5 | v24.5,35.75 24.75,36 30.25,36 30.5,35.75 U4.30 | v27.75,23 U1.49 | 20.25,32.25 v20,32.25 | v27,46.75 28.25,45.5 J4.4
  Layer3 0.1: v27.75,23 27.75,24.5 v20,32.25
  Bottom 0.1: v24.5,34.5 v24.5,35.75 24.5,44.25 v27,46.75
SWDIO  (via drill 0.3)
  Top 0.1: R19.2 30.5,45.5 29.75,45.5 J4.2 29.5,45.25 v29.5,43.75 | v30.75,36.25 U4.29 | U1.46 29.5,26.5 29.75,26.75 29.75,27.75 28.5,27.75 v28.25,27.5
  Layer2 0.1: v28.25,27.5 28.25,28.75 28.5,29 28.5,32 30.25,33.75 30.25,35.75 v30.75,36.25
  Bottom 0.1: v30.75,36.25 29.5,37.5 v29.5,43.75
VBAT
  Top 0.1: U1.1 28.25,13.75 20.5,13.75 20.25,13.5 11,13.5 9.75,14.75 7.75,14.75 7.75,15.5 8,15.75 10.75,15.75 11,15.5 20.5,15.5 21,16 D4.2
VBATT  (via drill 0.3)
  Top 0.1: v12.75,17.75 17,17.75 18.75,16 D4.1 | v7.5,20 7.25,20.25 EXT1.4
  Layer2 0.1: v12.75,17.75 11.25,19.25 10,19.25 9.25,20 v7.5,20
  Bottom 0.1: EXT1.4 7.5,20.25 v7.5,20
VCC-IN  (via drill 0.5)
  Top 0.3: v50.75,17.75 50,17.75 49.75,17.5 D2.A
  Bottom 0.3: v50.75,17.75 53.25,20.25 53.25,27.5 52.5,28.25 J1.VCC
VCCIO  (via drill 0.5)
  Top 0.3: EXB1.2 5.25,19.75 v4.5,19 4.5,16.25 | v16.75,24 R10.1 | v16.75,17 16,16.25 4.5,16.25 | 4.5,16.25 2.75,16.25 TP5.P$1 | v25.5,42.75 34,42.75 v34.25,42.5 | v15,38 21.75,38 22.25,37.5 25.5,37.5 v25.5,37.48
  Layer3 0.3: v16.75,24 21.75,24 23.25,25.5 v25.25,25.5
  Bottom 0.3: v4.5,19 4.5,19.25 5,19.75 EXB1.2 | v16.75,17 v16.75,24 | 27.75,31.75 27.75,34 27,34.75 SJ1.3 27,35 25.5,35 v25.5,37.48 v25.5,42.75 | 27.75,31.75 27.75,31 29,31 SJ4.3 | 34.5,42.5 34.5,43.75 SJ2.3 | 34.5,42.5 34.5,42 35.25,41.25 35.25,40 37.25,38 37.25,32.5 40.5,32.5 SJ3.3 | 34.5,42.5 v34.25,42.5 | v25.25,25.5 25.25,29.25 27.75,31.75 | SJ16.1 v15,38
VCCIO0  (via drill 0.5)
  Top 0.3: v31,34.25 31,35.25 | v31.5,39 U4.24
  Top 0.305: U4.31 31,35.25 C16.1 | U4.24 33,39.5 32.75,39.75 C19.1
  Bottom 0.3: 30.5,34.75 30,35.25 30,35.5 29.5,36 28,36 27.75,35.75 SJ1.2 | 30.5,34.75 v31,34.25 | v31.5,39 31.5,35.75 30.5,34.75
VCCIO1  (via drill 0.5)
  Top 0.305: U4.19 35.5,39.5 35.25,39.75 C15.1 35.77,40.77 v36.25,41
  Bottom 0.3: SJ2.2 35.25,42 v36.25,41
VCCIO2  (via drill 0.5)
  Top 0.3: U4.7 36,33 37,32.25 37,31.75 | C20.1 37,31.75 | 37,31.75 38.5,31.75 | 38.5,31.75 v39,31.75 | 38.5,31.75 v38.5,33.25
  Top 0.305: U4.15 38.25,37.75 v38.5,38 C14.1
  Bottom 0.3: v39,31.75 SJ3.2 | v38.5,33.25 v38.5,38
VCCIO3  (via drill 0.5)
  Top 0.305: U4.6 35.5,33.23 35.52,32.73 v36,32 C13.1
  Layer3 0.3: v30.5,31.25 31.75,31.25 33.25,32.75 35,32.75 35.75,32 v36,32
  Bottom 0.3: SJ4.2 30.5,31.75 v30.5,31.25
VDDA  (via drill 0.5)
  Top 0.3: 34.5,11 34.5,10 FB1.1 | 34.5,11 35.25,11 | 35.25,11 C11.1 | 34.5,11 C10.1 | v25,19.75 18.25,19.75 18,20 R5.2 | v27.75,16.75 28,16.5 34.75,16.5 v35,16.75 | 35.25,11 36,11.75 37.5,11.75 v38,12.25 38,13 36.5,14.5 34.75,14.5 34.5,14.25 U1.13
  Bottom 0.3: v25,19.75 27,17.75 27,17.5 v27.75,16.75 | v35,16.75 38,13.75 v38,12.25
VIN  (via drill 0.3)
  Top 0.1: v6.5,22.25 6,21.75 EXT1.10
  Bottom 0.1: EXT1.10 6.25,21.75 6.25,22 v6.5,22.25
VSSA  (via drill 0.5)
  Top 0.3: 36.5,10 36.5,11 C11.2 | 34,13 34,12.75 33.5,12.25 v33.5,12 33.5,11 C10.2 | 36.5,10 36.5,8.25 v34.75,8.25 | 36.5,10 FB2.1
  Top 0.305: U1.12 34,13
  Bottom 0.3: v34.75,8.25 34.25,8.75 34.25,11.25 v33.5,12